# EAGLE design GPIO Board Rev 3 V5 (EAGLE 9.6.2)

## Sheet 1 of 2

## Sheet 2 of 2
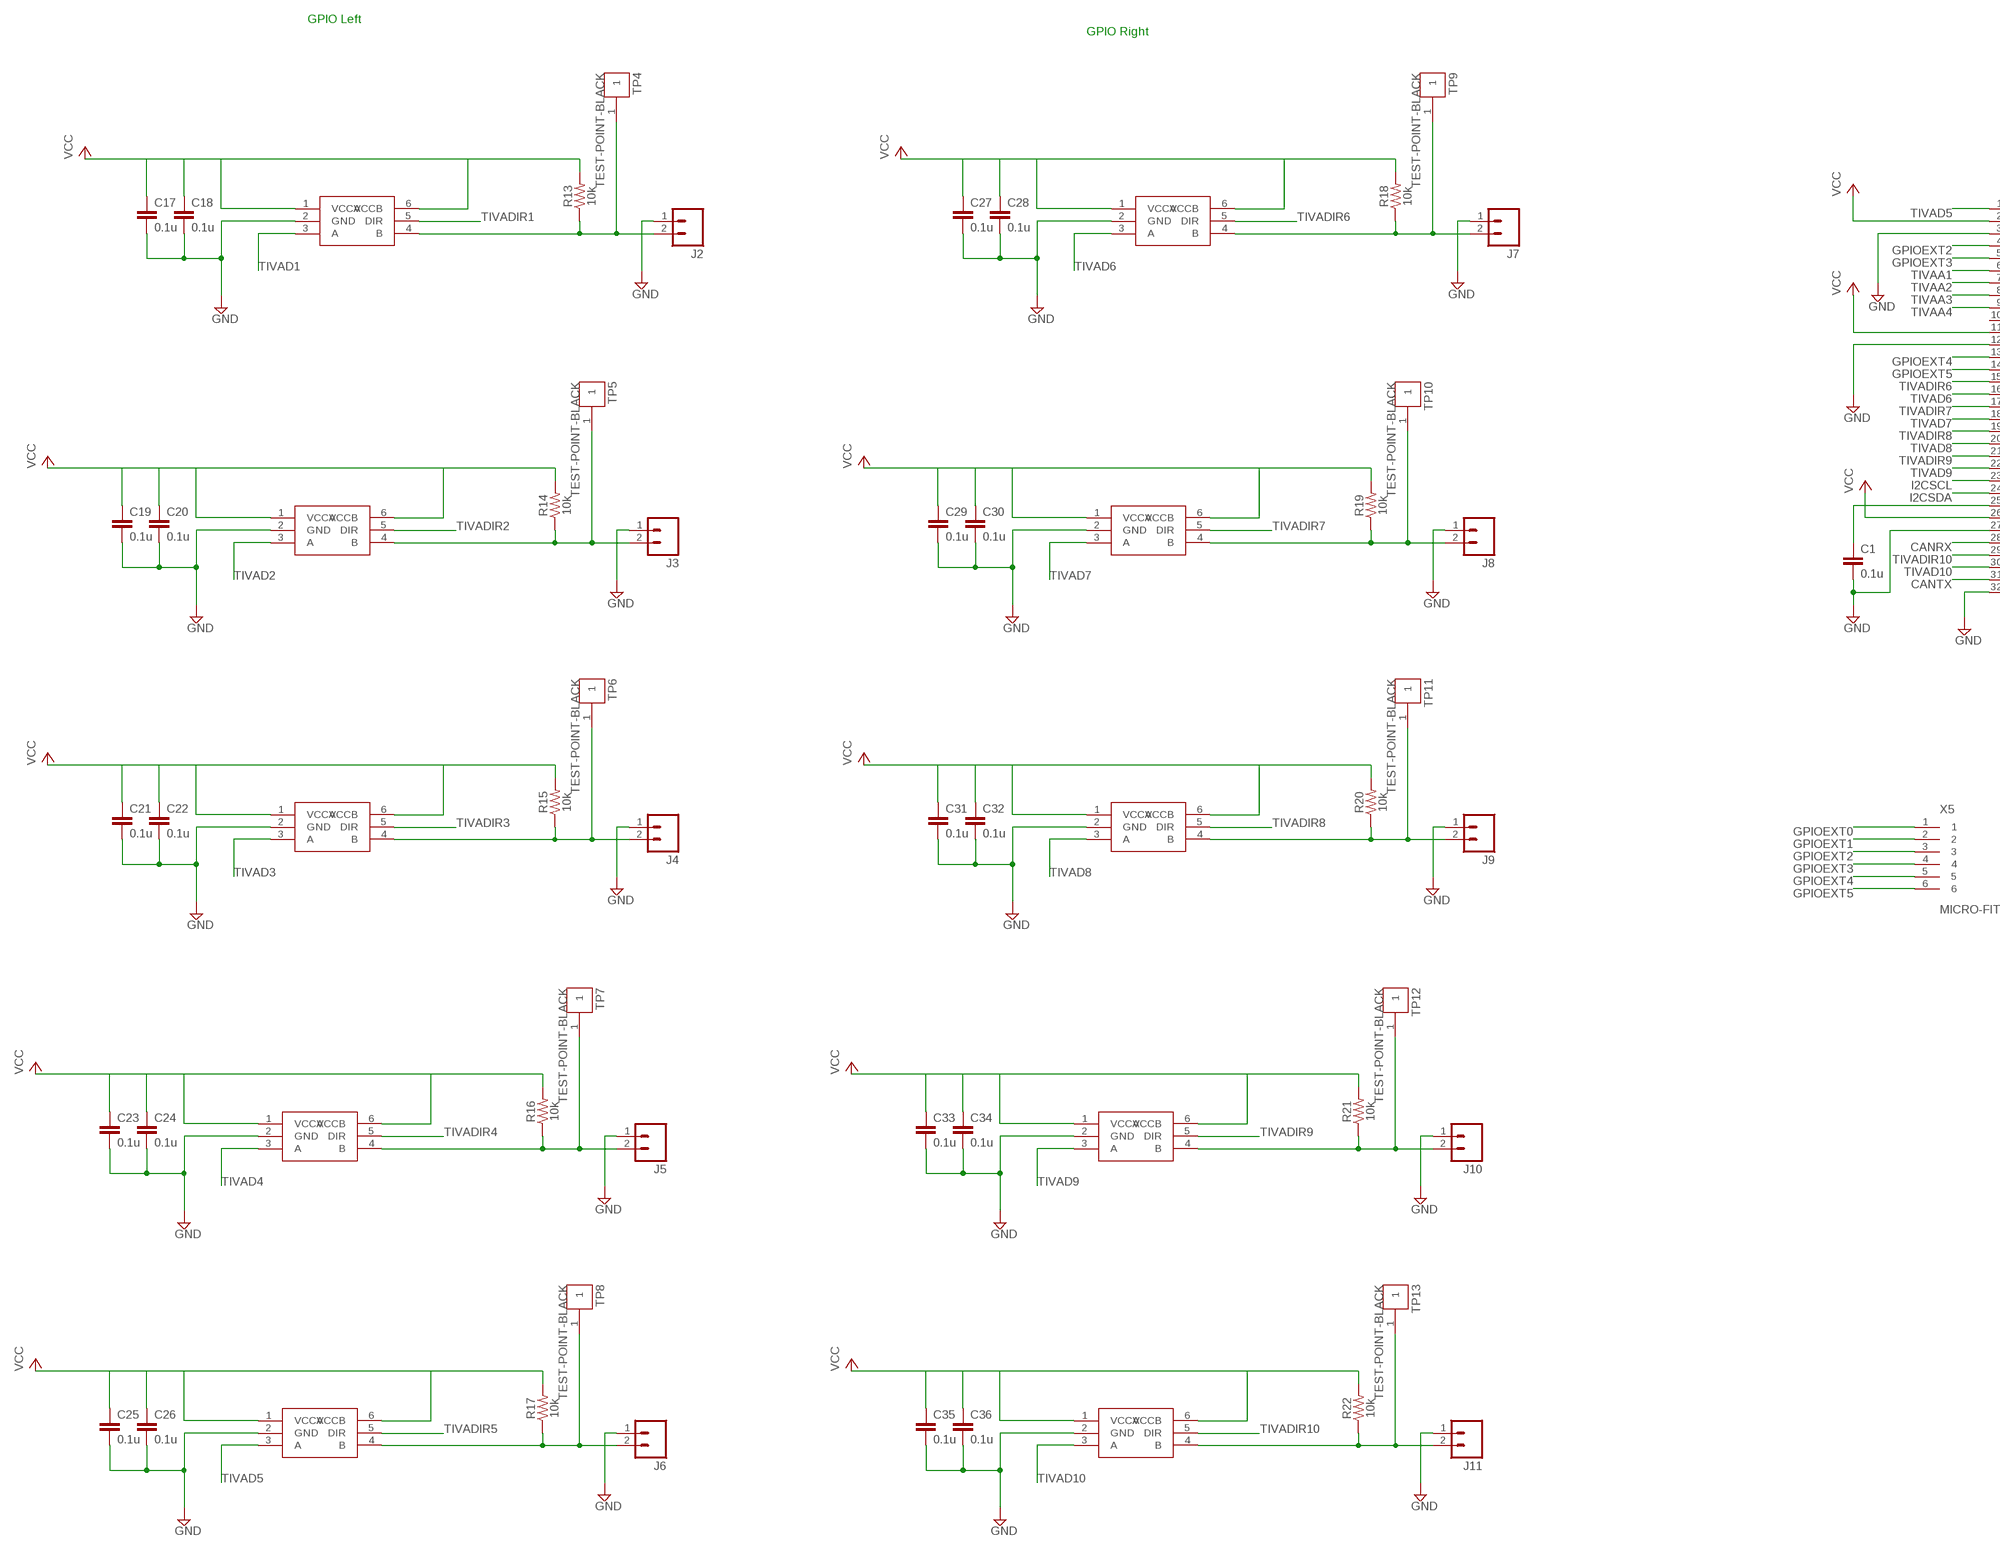
[diagram p0: schematic, sheet 2, part 1 of 3]
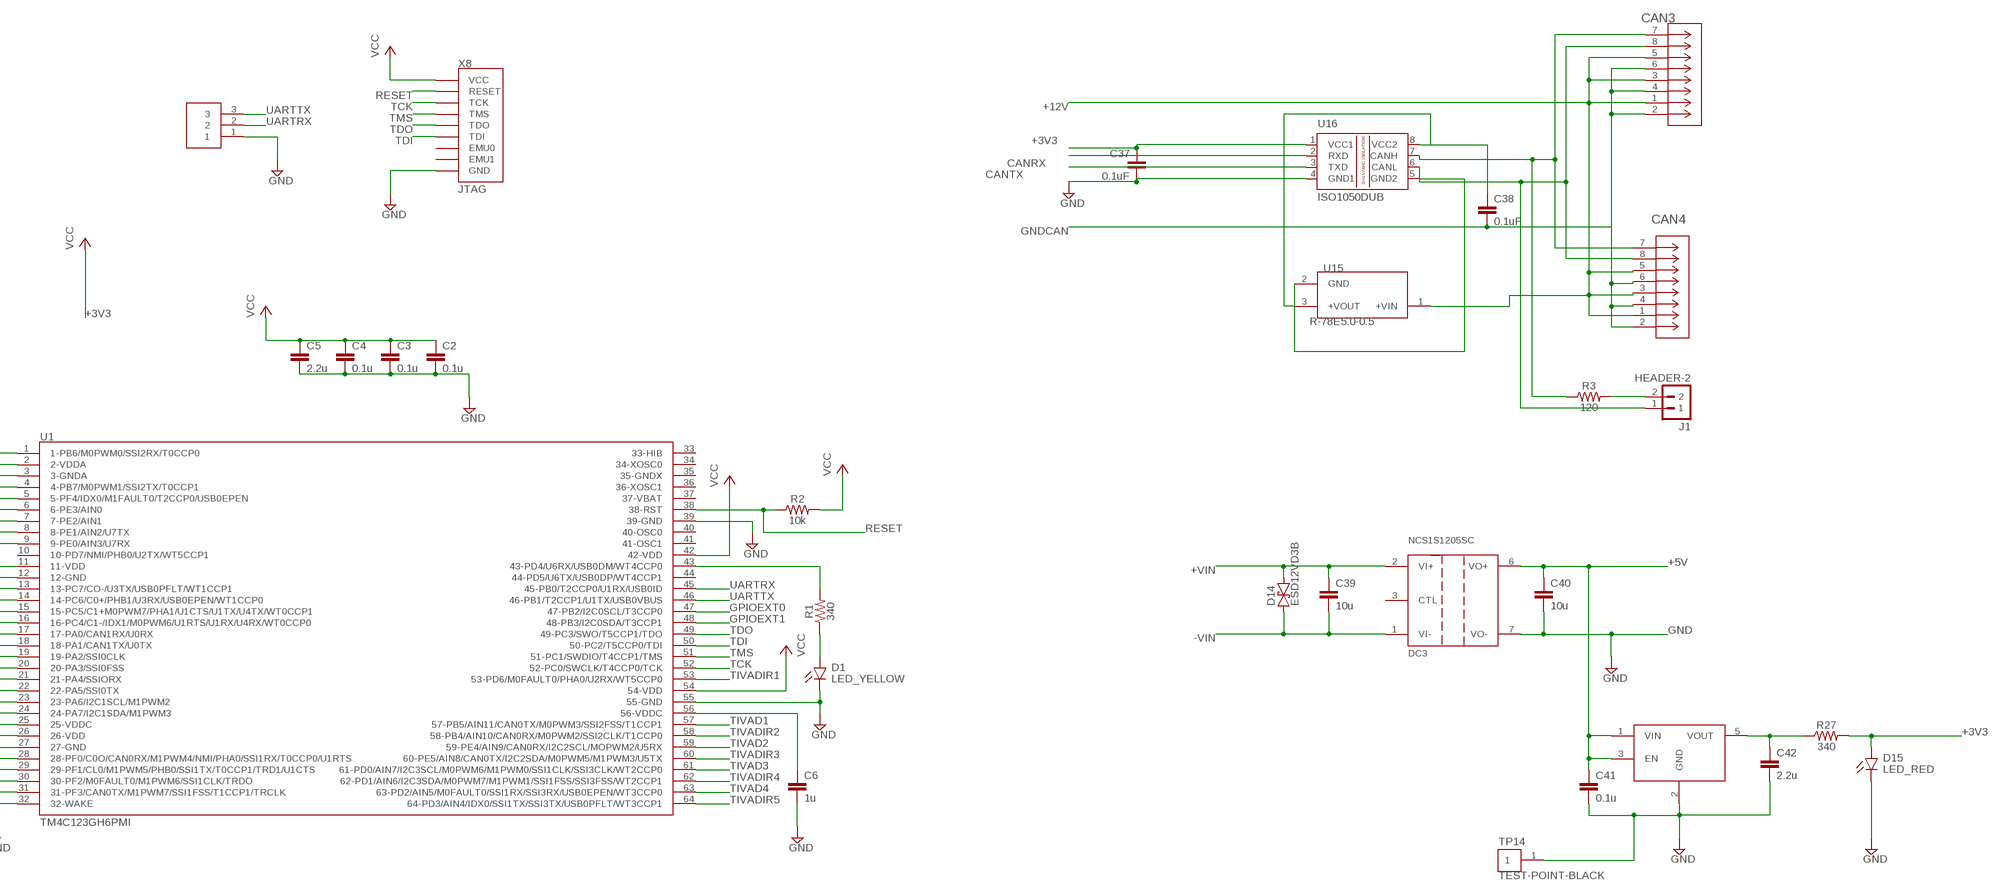
[diagram p1: schematic, sheet 2, part 2 of 3]
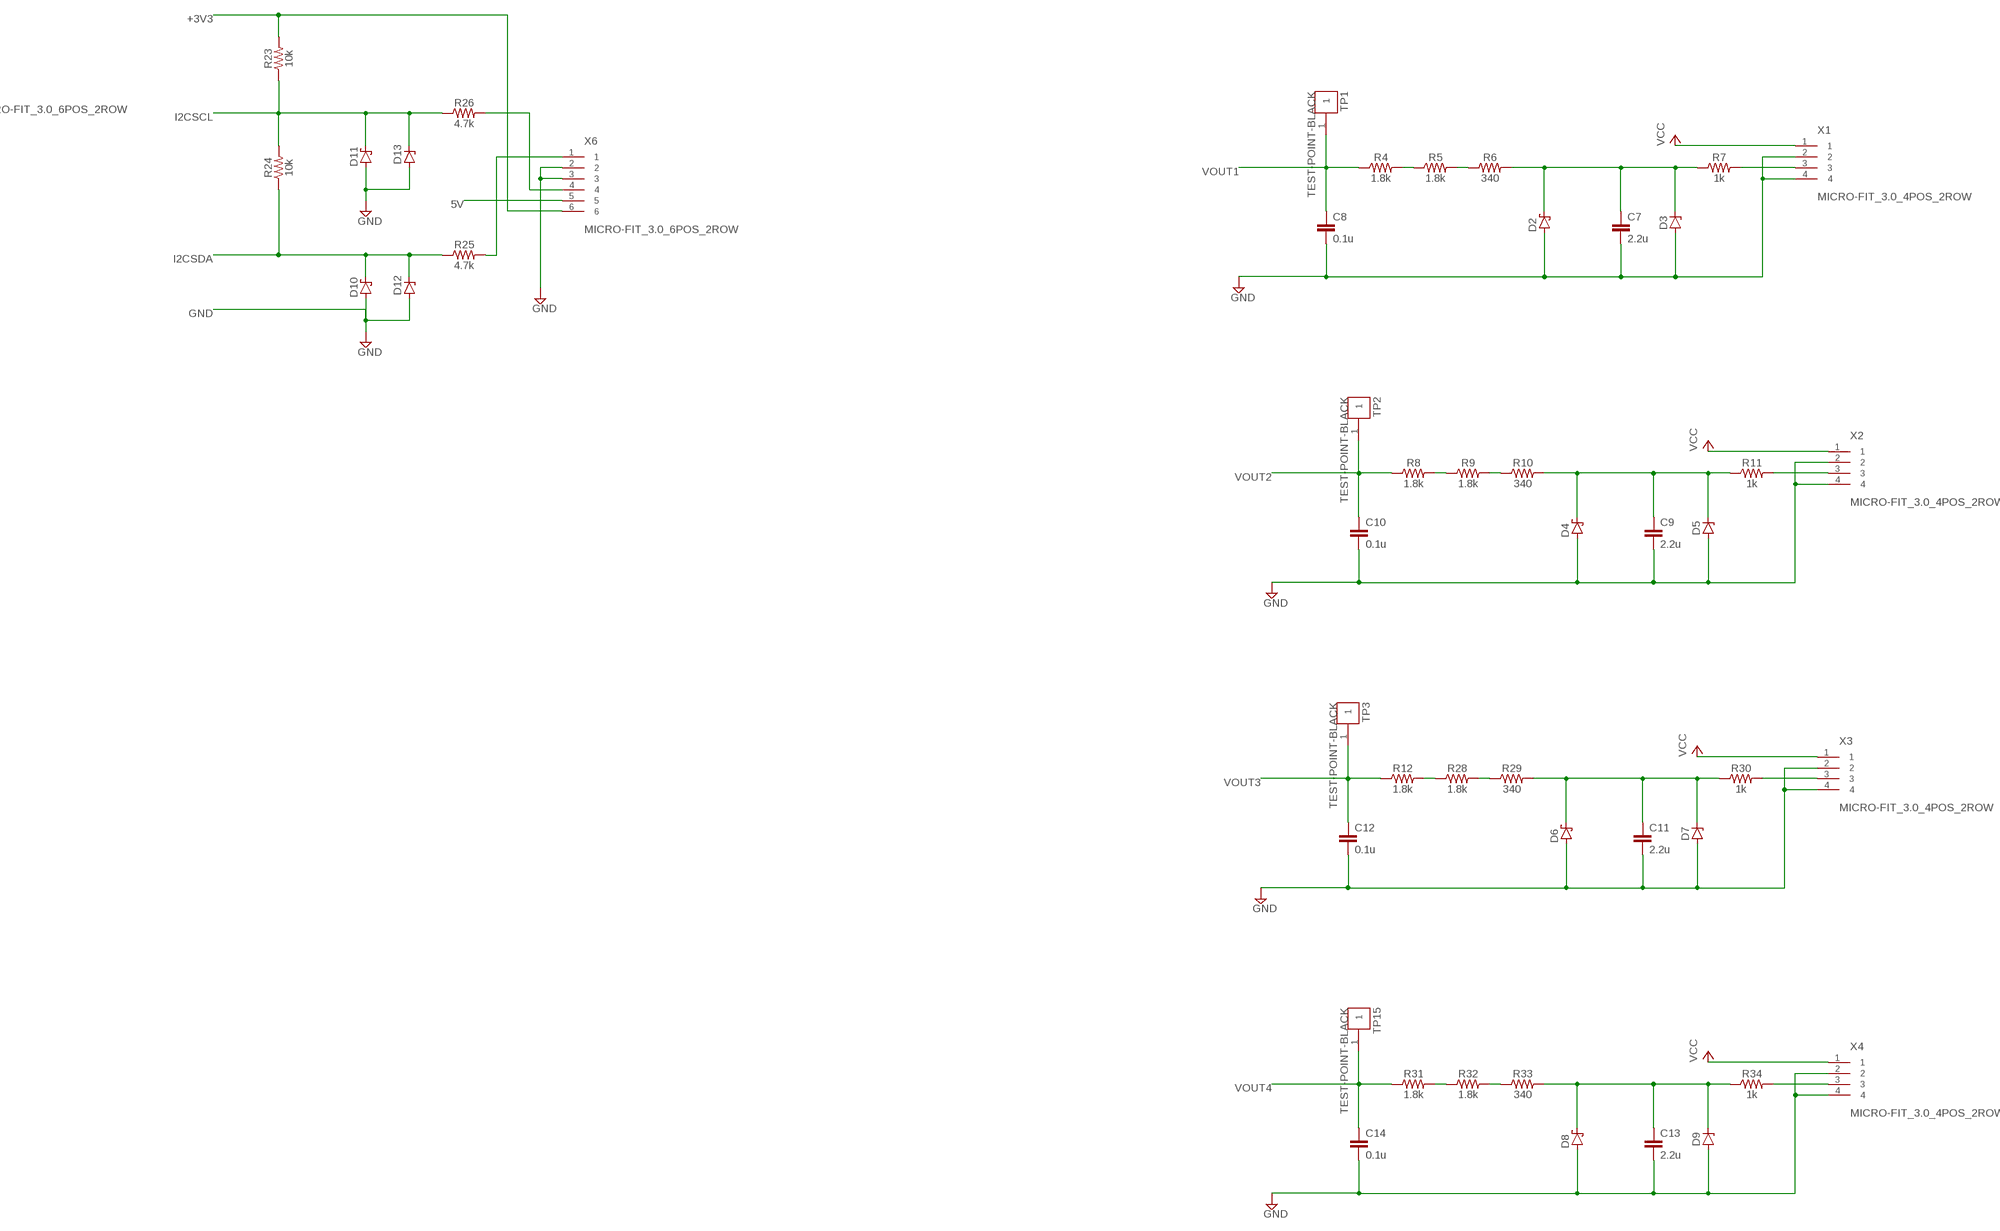
[diagram p2: schematic, sheet 2, part 3 of 3]

### Parts
C1  0.1u  CAP-0.1UF-0603-25V-X8R  [C0603]
C2  0.1u  CAP-0.1UF-0603-25V-X8R  [C0603]
C3  0.1u  CAP-0.1UF-0603-25V-X8R  [C0603]
C4  0.1u  CAP-0.1UF-0603-25V-X8R  [C0603]
C5  2.2u  CAP-2.2UF-0603-6.3V-X7R  [C0603]
C6  1u  CAP-1UF-0603-25V-X7R  [C0603]
C7  2.2u  CAP-2.2UF-0603-6.3V-X7R  [C0603]
C8  0.1u  CAP-0.1UF-0603-25V-X8R  [C0603]
C9  2.2u  CAP-2.2UF-0603-6.3V-X7R  [C0603]
C10  0.1u  CAP-0.1UF-0603-25V-X8R  [C0603]
C11  2.2u  CAP-2.2UF-0603-6.3V-X7R  [C0603]
C12  0.1u  CAP-0.1UF-0603-25V-X8R  [C0603]
C13  2.2u  CAP-2.2UF-0603-6.3V-X7R  [C0603]
C14  0.1u  CAP-0.1UF-0603-25V-X8R  [C0603]
C17  0.1u  CAP-0.1UF-0402-16V-X7R  [C0402]
C18  0.1u  CAP-0.1UF-0402-16V-X7R  [C0402]
C19  0.1u  CAP-0.1UF-0402-16V-X7R  [C0402]
C20  0.1u  CAP-0.1UF-0402-16V-X7R  [C0402]
C21  0.1u  CAP-0.1UF-0402-16V-X7R  [C0402]
C22  0.1u  CAP-0.1UF-0402-16V-X7R  [C0402]
C23  0.1u  CAP-0.1UF-0402-16V-X7R  [C0402]
C24  0.1u  CAP-0.1UF-0402-16V-X7R  [C0402]
C25  0.1u  CAP-0.1UF-0402-16V-X7R  [C0402]
C26  0.1u  CAP-0.1UF-0402-16V-X7R  [C0402]
C27  0.1u  CAP-0.1UF-0402-16V-X7R  [C0402]
C28  0.1u  CAP-0.1UF-0402-16V-X7R  [C0402]
C29  0.1u  CAP-0.1UF-0402-16V-X7R  [C0402]
C30  0.1u  CAP-0.1UF-0402-16V-X7R  [C0402]
C31  0.1u  CAP-0.1UF-0402-16V-X7R  [C0402]
C32  0.1u  CAP-0.1UF-0402-16V-X7R  [C0402]
C33  0.1u  CAP-0.1UF-0402-16V-X7R  [C0402]
C34  0.1u  CAP-0.1UF-0402-16V-X7R  [C0402]
C35  0.1u  CAP-0.1UF-0402-16V-X7R  [C0402]
C36  0.1u  CAP-0.1UF-0402-16V-X7R  [C0402]
C37  0.1uF  C5/3.5  [C5B3.5]
C38  0.1uF  C2.5/4  [C2.5-4]
C39  10u  CAP-10UF-10%-16V-X7R-1206IPC  [1206]
C40  10u  CAP-10UF-10%-16V-X7R-1206IPC  [1206]
C41  0.1u  CAP-0.1UF-0603-25V-X8R  [C0603]
C42  2.2u  CAP-2.2UF-10%-6.3V-X7R-0603IPC  [0603]
CAN3  A-2004-2-4-LPS-N-R  [CONN_4-LPS-N-R_ASM]
CAN4  A-2004-2-4-LPS-N-R  [CONN_4-LPS-N-R_ASM]
D1  LED_YELLOW  CHIP-FLAT-Y_0603-0.35MM  [LEDC1608X35N_FLAT-Y]
D2  SCHOTTKY-DIODESMD  [SMB]
D3  ZENER-DIODESMB  [SMB]
D4  SCHOTTKY-DIODESMD  [SMB]
D5  ZENER-DIODESMB  [SMB]
D6  SCHOTTKY-DIODESMD  [SMB]
D7  ZENER-DIODESMB  [SMB]
D8  SCHOTTKY-DIODESMD  [SMB]
D9  ZENER-DIODESMB  [SMB]
D10  SCHOTTKY-DIODESMD  [SMB]
D11  SCHOTTKY-DIODESMD  [SMB]
D12  ZENER-DIODESOT23  [SOT23]
D13  ZENER-DIODESOT23  [SOT23]
D14  ESD12VD3B  [SOD23]
D15  LED_RED  CHIP-FLAT-R_0805  [LEDC2012X110N_FLAT-R]
DC3  NCS1S1205SC  [7-SIP]
DC4  NCV551SN33T1G  [SOT23-5]
J1  HEADER-2  [HEADER-V-1X2]
J2  M02-JST-2-PTH-NO_SILK  [JST-2-PTH-NS]
J3  M02-JST-2-PTH-NO_SILK  [JST-2-PTH-NS]
J4  M02-JST-2-PTH-NO_SILK  [JST-2-PTH-NS]
J5  M02-JST-2-PTH-NO_SILK  [JST-2-PTH-NS]
J6  M02-JST-2-PTH-NO_SILK  [JST-2-PTH-NS]
J7  M02-JST-2-PTH-NO_SILK  [JST-2-PTH-NS]
J8  M02-JST-2-PTH-NO_SILK  [JST-2-PTH-NS]
J9  M02-JST-2-PTH-NO_SILK  [JST-2-PTH-NS]
J10  M02-JST-2-PTH-NO_SILK  [JST-2-PTH-NS]
J11  M02-JST-2-PTH-NO_SILK  [JST-2-PTH-NS]
R1  340  RES-340OHM-0603-1/10W-1%  [R0603]
R2  10k  RES-10KOHM-0603-1/10W-1%  [R0603]
R3  120  RES-120OHM-0603-1/10W-1%  [R0603]
R4  1.8k  RES-1.8KOHM-0603-1/10W-.1%  [R0603]
R5  1.8k  RES-1.8KOHM-0603-1/10W-.1%  [R0603]
R6  340  RES-340OHM-0603-1/10W-1%  [R0603]
R7  1k  RES-1KOHM-0603-1/10W-1%  [R0603]
R8  1.8k  RES-1.8KOHM-0603-1/10W-.1%  [R0603]
R9  1.8k  RES-1.8KOHM-0603-1/10W-.1%  [R0603]
R10  340  RES-340OHM-0603-1/10W-1%  [R0603]
R11  1k  RES-1KOHM-0603-1/10W-1%  [R0603]
R12  1.8k  RES-1.8KOHM-0603-1/10W-.1%  [R0603]
R13  10k  RES-10KOHM-1%-0.1W-0603IPC  [0603]
R14  10k  RES-10KOHM-1%-0.1W-0603IPC  [0603]
R15  10k  RES-10KOHM-1%-0.1W-0603IPC  [0603]
R16  10k  RES-10KOHM-1%-0.1W-0603IPC  [0603]
R17  10k  RES-10KOHM-1%-0.1W-0603IPC  [0603]
R18  10k  RES-10KOHM-1%-0.1W-0603IPC  [0603]
R19  10k  RES-10KOHM-1%-0.1W-0603IPC  [0603]
R20  10k  RES-10KOHM-1%-0.1W-0603IPC  [0603]
R21  10k  RES-10KOHM-1%-0.1W-0603IPC  [0603]
R22  10k  RES-10KOHM-1%-0.1W-0603IPC  [0603]
R23  10k  RES-10KOHM-0603-1/10W-1%  [R0603]
R24  10k  RES-10KOHM-0603-1/10W-1%  [R0603]
R25  4.7k  RES-4.7KOHM-0603-1/10W-1%  [R0603]
R26  4.7k  RES-4.7KOHM-0603-1/10W-1%  [R0603]
R27  340  RES-340OHM-0603-1/10W-1%  [R0603]
R28  1.8k  RES-1.8KOHM-0603-1/10W-.1%  [R0603]
R29  340  RES-340OHM-0603-1/10W-1%  [R0603]
R30  1k  RES-1KOHM-0603-1/10W-1%  [R0603]
R31  1.8k  RES-1.8KOHM-0603-1/10W-.1%  [R0603]
R32  1.8k  RES-1.8KOHM-0603-1/10W-.1%  [R0603]
R33  340  RES-340OHM-0603-1/10W-1%  [R0603]
R34  1k  RES-1KOHM-0603-1/10W-1%  [R0603]
TP1  TEST-POINT-BLACK  [KEYSTONE_5001_0]
TP2  TEST-POINT-BLACK  [KEYSTONE_5001_0]
TP3  TEST-POINT-BLACK  [KEYSTONE_5001_0]
TP4  TEST-POINT-BLACK  [KEYSTONE_5001_0]
TP5  TEST-POINT-BLACK  [KEYSTONE_5001_0]
TP6  TEST-POINT-BLACK  [KEYSTONE_5001_0]
TP7  TEST-POINT-BLACK  [KEYSTONE_5001_0]
TP8  TEST-POINT-BLACK  [KEYSTONE_5001_0]
TP9  TEST-POINT-BLACK  [KEYSTONE_5001_0]
TP10  TEST-POINT-BLACK  [KEYSTONE_5001_0]
TP11  TEST-POINT-BLACK  [KEYSTONE_5001_0]
TP12  TEST-POINT-BLACK  [KEYSTONE_5001_0]
TP13  TEST-POINT-BLACK  [KEYSTONE_5001_0]
TP14  TEST-POINT-BLACK  [KEYSTONE_5001_0]
TP15  TEST-POINT-BLACK  [KEYSTONE_5001_0]
U1  TM4C123GH6PMI  [S-PQFP-G64]
U5  SN74LVC1T45-Q1  [SC70]
U6  SN74LVC1T45-Q1  [SC70]
U7  SN74LVC1T45-Q1  [SC70]
U8  SN74LVC1T45-Q1  [SC70]
U9  SN74LVC1T45-Q1  [SC70]
U10  SN74LVC1T45-Q1  [SC70]
U11  SN74LVC1T45-Q1  [SC70]
U12  SN74LVC1T45-Q1  [SC70]
U13  SN74LVC1T45-Q1  [SC70]
U14  SN74LVC1T45-Q1  [SC70]
U15  R-78E5.0-0.5  [CONV_R-78E5.0-0.5]
U16  ISO1050DUB  [DUB-R-PDSO-G8]
U$2  HEADER-3  [HEADER-V-1X3]
X1  MICRO-FIT_3.0_4POS_2ROW  [0430450412]
X2  MICRO-FIT_3.0_4POS_2ROW  [0430450412]
X3  MICRO-FIT_3.0_4POS_2ROW  [0430450412]
X4  MICRO-FIT_3.0_4POS_2ROW  [0430450412]
X5  MICRO-FIT_3.0_6POS_2ROW  [0430450612]
X6  MICRO-FIT_3.0_6POS_2ROW  [0430450612]
X8  JTAG  [HEADER-V-2X7]

### Nets
5V: X6.5
+3V3: C37.2 D15.A R23.2 R27.2 U16.1(VCC1) X6.6 ; supply symbol labelled VCC
+5V: C40.1 C41.1 DC3.6(VO+) DC4.1(VIN) DC4.3(EN)
+12V: CAN3.1 CAN3.3 CAN3.5 CAN4.1 CAN4.3 CAN4.5 U15.1(+VIN)
+VIN: C39.1 D14.2 DC3.2(VI+)
-VIN: C39.2 D14.1 DC3.1(VI-)
CANRX: U1.28(28-PF0/C0O/CAN0RX/M1PWM4/NMI/PHA0/SSI1RX/T0CCP0/U1RTS) U16.2(RXD)
CANTX: U1.31(31-PF3/CAN0TX/M1PWM7/SSI1FSS/T1CCP1/TRCLK) U16.3(TXD)
GND: C1.2 C2.2 C3.2 C4.2 C5.2 C6.2 C7.2 C8.2 C9.2 C10.2 C11.2 C12.2 C13.2 C14.2 C17.2 C18.2 C19.2 C20.2 C21.2 C22.2 C23.2 C24.2 C25.2 C26.2 C27.2 C28.2 C29.2 C30.2 C31.2 C32.2 C33.2 C34.2 C35.2 C36.2 C37.1 C40.2 C41.2 C42.2 D1.C D2.A D3.A D4.A D5.A D6.A D7.A D8.A D9.A D10.A D11.A D12.1(A) D13.1(A) D15.C DC3.7(VO-) DC4.2(GND) J2.1 J3.1 J4.1 J5.1 J6.1 J7.1 J8.1 J9.1 J10.1 J11.1 TP14.1 U1.3(3-GNDA) U1.12(12-GND) U1.27(27-GND) U1.32(32-WAKE) U1.39(39-GND) U1.55(55-GND) U5.2(GND) U6.2(GND) U7.2(GND) U8.2(GND) U9.2(GND) U10.2(GND) U11.2(GND) U12.2(GND) U13.2(GND) U14.2(GND) U16.4(GND1) U$2.1 X1.2 X1.4 X2.2 X2.4 X3.2 X3.4 X4.2 X4.4 X6.2 X6.3 X8.4(GND) X8.6(GND) X8.8(GND) X8.10(GND) X8.12(GND)
GNDCAN: C38.2 CAN3.2 CAN3.4 CAN3.6 CAN4.2 CAN4.4 CAN4.6
GPIOEXT0: U1.47(47-PB2/I2C0SCL/T3CCP0) X5.1
GPIOEXT1: U1.48(48-PB3/I2C0SDA/T3CCP1) X5.2
GPIOEXT2: U1.4(4-PB7/M0PWM1/SSI2TX/T0CCP1) X5.3
GPIOEXT3: U1.5(5-PF4/IDX0/M1FAULT0/T2CCP0/USB0EPEN) X5.4
GPIOEXT4: U1.13(13-PC7/CO-/U3TX/USB0PFLT/WT1CCP1) X5.5
GPIOEXT5: U1.14(14-PC6/C0+/PHB1/U3RX/USB0EPEN/WT1CCP0) X5.6
I2CSCL: D11.C D13.3(C) R23.1 R24.2 R26.1 U1.23(23-PA6/I2C1SCL/M1PWM2)
I2CSDA: D10.C D12.3(C) R24.1 R25.1 U1.24(24-PA7/I2C1SDA/M1PWM3)
N$1: R1.2 U1.43(43-PD4/U6RX/USB0DM/WT4CCP0)
N$2: D1.A R1.1
N$3: J1.2 R3.2
N$4: CAN3.7 CAN4.7 R3.1 U16.7(CANH)
N$5: C1.1 U1.25(25-VDDC)
N$6: CAN3.8 CAN4.8 J1.1 U16.6(CANL)
N$7: R7.2 X1.3
N$8: C6.1 U1.56(56-VDDC)
N$9: C7.1 D2.C D3.C R6.2 R7.1
N$10: R5.2 R6.1
N$11: R4.2 R5.1
N$12: R11.2 X2.3
N$13: C9.1 D4.C D5.C R10.2 R11.1
N$14: R9.2 R10.1
N$15: R8.2 R9.1
N$16: R30.2 X3.3
N$17: C11.1 D6.C D7.C R29.2 R30.1
N$18: R28.2 R29.1
N$19: R12.2 R28.1
N$20: R34.2 X4.3
N$21: J2.2 R13.1 TP4.1 U5.4(B)
N$22: U5.1(VCCA)
N$23: J7.2 R18.1 TP9.1 U10.4(B)
N$24: C17.1
N$25: J3.2 R14.1 TP5.1 U6.4(B)
N$26: U6.1(VCCA)
N$27: U10.1(VCCA)
N$28: C19.1
N$29: J4.2 R15.1 TP6.1 U7.4(B)
N$30: U7.1(VCCA)
N$31: C27.1
N$32: C21.1
N$33: J5.2 R16.1 TP7.1 U8.4(B)
N$34: U8.1(VCCA)
N$35: J8.2 R19.1 TP10.1 U11.4(B)
N$36: C23.1
N$37: J6.2 R17.1 TP8.1 U9.4(B)
N$38: U9.1(VCCA)
N$39: U11.1(VCCA)
N$40: C25.1
N$41: C29.1
N$42: J9.2 R20.1 TP11.1 U12.4(B)
N$43: U12.1(VCCA)
N$44: C31.1
N$45: J10.2 R21.1 TP12.1 U13.4(B)
N$46: U13.1(VCCA)
N$47: C33.1
N$48: J11.2 R22.1 TP13.1 U14.4(B)
N$49: U14.1(VCCA)
N$50: C35.1
N$51: R26.2 X6.4
N$52: R25.2 X6.1
N$53: C13.1 D8.C D9.C R33.2 R34.1
N$54: R32.2 R33.1
N$55: U15.3(+VOUT)
N$56: U15.2(GND) U16.5(GND2)
N$57: C38.1 U16.8(VCC2)
N$58: C42.1 DC4.5(VOUT) R27.1
N$59: R31.2 R32.1
RESET: R2.1 U1.38(38-RST) X8.2(RESET)
TCK: U1.52(52-PC0/SWCLK/T4CCP0/TCK) X8.9(TCK) X8.11(TCK)
TDI: U1.50(50-PC2/T5CCP0/TDI) X8.3(TDI)
TDO: U1.49(49-PC3/SWO/T5CCP1/TDO) X8.7(TDO)
TIVAA1: U1.6(6-PE3/AIN0)
TIVAA2: U1.7(7-PE2/AIN1)
TIVAA3: U1.8(8-PE1/AIN2/U7TX)
TIVAA4: U1.9(9-PE0/AIN3/U7RX)
TIVAD1: U1.57(57-PB5/AIN11/CAN0TX/M0PWM3/SSI2FSS/T1CCP1) U5.3(A)
TIVAD2: U1.59(59-PE4/AIN9/CAN0RX/I2C2SCL/MOPWM2/U5RX) U6.3(A)
TIVAD3: U1.61(61-PD0/AIN7/I2C3SCL/M0PWM6/M1PWM0/SSI1CLK/SSI3CLK/WT2CCP0) U7.3(A)
TIVAD4: U1.63(63-PD2/AIN5/M0FAULT0/SSI1RX/SSI3RX/USB0EPEN/WT3CCP0) U8.3(A)
TIVAD5: U1.1(1-PB6/M0PWM0/SSI2RX/T0CCP0) U9.3(A)
TIVAD6: U1.16(16-PC4/C1-/IDX1/M0PWM6/U1RTS/U1RX/U4RX/WT0CCP0) U10.3(A)
TIVAD7: U1.18(18-PA1/CAN1TX/U0TX) U11.3(A)
TIVAD8: U1.20(20-PA3/SSI0FSS) U12.3(A)
TIVAD9: U1.22(22-PA5/SSI0TX) U13.3(A)
TIVAD10: U1.30(30-PF2/M0FAULT0/M1PWM6/SSI1CLK/TRDO) U14.3(A)
TIVADIR1: U1.53(53-PD6/M0FAULT0/PHA0/U2RX/WT5CCP0) U5.5(DIR)
TIVADIR2: U1.58(58-PB4/AIN10/CAN0RX/M0PWM2/SSI2CLK/T1CCP0) U6.5(DIR)
TIVADIR3: U1.60(60-PE5/AIN8/CAN0TX/I2C2SDA/M0PWM5/M1PWM3/U5TX) U7.5(DIR)
TIVADIR4: U1.62(62-PD1/AIN6/I2C3SDA/M0PWM7/M1PWM1/SSI1FSS/SSI3FSS/WT2CCP1) U8.5(DIR)
TIVADIR5: U1.64(64-PD3/AIN4/IDX0/SSI1TX/SSI3TX/USB0PFLT/WT3CCP1) U9.5(DIR)
TIVADIR6: U1.15(15-PC5/C1+M0PWM7/PHA1/U1CTS/U1TX/U4TX/WT0CCP1) U10.5(DIR)
TIVADIR7: U1.17(17-PA0/CAN1RX/U0RX) U11.5(DIR)
TIVADIR8: U1.19(19-PA2/SSI0CLK) U12.5(DIR)
TIVADIR9: U1.21(21-PA4/SSIORX) U13.5(DIR)
TIVADIR10: U1.29(29-PF1/CL0/M1PWM5/PHB0/SSI1TX/T0CCP1/TRD1/U1CTS) U14.5(DIR)
TMS: U1.51(51-PC1/SWDIO/T4CCP1/TMS) X8.1(TMS)
UARTRX: U1.45(45-PB0/T2CCP0/U1RX/USB0ID) U$2.2
UARTTX: U1.46(46-PB1/T2CCP1/U1TX/USB0VBUS) U$2.3
VCC: C2.1 C3.1 C4.1 C5.1 C18.1 C20.1 C22.1 C24.1 C26.1 C28.1 C30.1 C32.1 C34.1 C36.1 R2.2 R13.2 R14.2 R15.2 R16.2 R17.2 R18.2 R19.2 R20.2 R21.2 R22.2 U1.2(2-VDDA) U1.11(11-VDD) U1.26(26-VDD) U1.42(42-VDD) U1.54(54-VDD) U5.6(VCCB) U6.6(VCCB) U7.6(VCCB) U8.6(VCCB) U9.6(VCCB) U10.6(VCCB) U11.6(VCCB) U12.6(VCCB) U13.6(VCCB) U14.6(VCCB) X1.1 X2.1 X3.1 X4.1 X8.5(VCC)
VOUT1: C8.1 R4.1 TP1.1
VOUT2: C10.1 R8.1 TP2.1
VOUT3: C12.1 R12.1 TP3.1
VOUT4: C14.1 R31.1 TP15.1
Unconnected: DC3.3(CTL) U1.10(10-PD7/NMI/PHB0/U2TX/WT5CCP1) U1.33(33-HIB) U1.34(34-XOSC0) U1.35(35-GNDX) U1.36(36-XOSC1) U1.37(37-VBAT) U1.40(40-OSC0) U1.41(41-OSC1) U1.44(44-PD5/U6TX/USB0DP/WT4CCP1) X8.13(EMU0) X8.14(EMU1)

### Notes on the sheet
- GPIO Left
- GPIO Right

## Library data of the parts
C1-C4 C8 C10 C12 C14 C41 = gtsr-passive:CAP-0.1UF: 0.1µF Ceramic Capacitor; MANUFACTURER: Murata Electronics; MFPN: GCM188R91E104KA37D; SUPPLIER: Digi-Key; SUPPLIER_PN: 490-14359-1-ND
C5 C7 C9 C11 C13 = gtsr-passive:CAP-2.2UF: 2.2µF Ceramic Capacitor; AUTOMOTIVE: Yes; MANUFACTURER: Murata; MFPN: GCM188R70J225KE22J; SUPPLIER: Digikey; SUPPLIER_PN: 490-14529-1-ND
C6 = gtsr-passive:CAP-1UF: 1µF Ceramic Capacitor; MANUFACTURER: Murata; MFPN: GCM188R71E105KA64D; SUPPLIER: Digikey; SUPPLIER_PN: 490-10673-1-ND
C17-C36 = gtsr-passive:CAP-0.1UF: 0.1µF Ceramic Capacitor; MANUFACTURER: Murata; MFPN: GCM155R71C104KA55D; SUPPLIER: Digikey; SUPPLIER_PN: 490-4759-1-ND
C37 C38 = capacitor-wima:C: CAPACITOR naming: grid - package width
C39 C40 = gtsr-passive:CAP-10UF: 10µF Ceramic Capacitor; MFR: Murata Electronics; MPN: GCM31CR71C106KA64K; SPN: 490-14746-1-ND; SPR: Digi-Key
C42 = gtsr-passive:CAP-2.2UF: 2.2µF Ceramic Capacitor; MFR: Murata Electronics; MPN: GCM188R70J225KE22D; SPN: 490-5316-1-ND; SPR: Digi-Key
CAN3 CAN4 = A-2004-2-4-LPS-N-R:A-2004-2-4-LPS-N-R; COPYRIGHT: Copyright (C) 2021 Ultra Librarian. All rights reserved.; DIGI-KEY_PART_NUMBER_1: AE10387-ND; MANUFACTURER_PART_NUMBER: A-2004-2-4-LPS-N-R; MFR_NAME: Assmann
D1 = LED:CHIP-FLAT-Y; CATEGORY: LED; COLOR: YELLOW; DESCRIPTION: CHIP LED FLAT; SUB-CATEGORY: CHIP; TYPE: FLAT_TOP
D2 D4 D6 D8 D10 D11 = diode:SCHOTTKY-DIODE: Schottky Diode
D3 D5 D7 D9 D12 D13 = diode:ZENER-DIODE: Z-Diode
D14 = gtsr-diode:ESD12VD3B; MANUFACTURER: Micro Commercial Co; MFPN: ESD12VD3B-TP; SUPPLIER: Digikey; SUPPLIER_PN: ESD12VD3B-TPMSCT-ND
D15 = LED:CHIP-FLAT-R; CATEGORY: LED; COLOR: RED; DESCRIPTION: CHIP LED FLAT; SUB-CATEGORY: CHIP; TYPE: FLAT_TOP
DC3 = gtsr-power-supply:NCS1S1205SC: Isolated Module DC DC Converter 1 Output 5V 200mA 4.5V - 18V Input; MANUFACTURER: Murata; MFPN: NCS1S1205SC; SUPPLIER: Digikey; SUPPLIER_PN: 811-2945-ND
DC4 = gtsr-power-supply:NCV551; AUTOMOTIVE: Yes; MANUFACTURER: ON Semiconductor; MFPN: NCV551SN33T1G; SUPPLIER: Digikey; SUPPLIER_PN: NCV551SN33T1GOSCT-ND; VOUT: 3.3
J1 = gtsr-connector:HEADER-2; MANUFACTURER: Molex; MFPN: 0022284027; SUPPLIER: Digikey; SUPPLIER_PN: WM24201-ND
J2-J11 = gtsr-connector:M02: Standard 2-pin 0.1" header. Use with - straight break away headers ( PRT-00116) - right angle break away headers (PRT-00553) - swiss pins (PRT-00743) - machine pins (PRT-00117) - female headers (PRT-00115) Molex polarized connector foot print use with: PRT-08233 with associated crimp pins and housings. 2.54_SCREWTERM for use with PRT-10571. 3.5mm Screw Terminal footprints for PRT-08084 5mm Screw Terminal footprints for use with PRT-08432 Copied from SparkFun Connector
R1 R6 R10 R27 R29 R33 = gtsr-passive:RES-340OHM; MANUFACTURER: Panasonic; MFPN: ERJ-3EKF3400V; SUPPLIER: Digikey; SUPPLIER_PN: P340HCT-ND
R2 R23 R24 = gtsr-passive:RES-10KOHM; MANUFACTURER: Panasonic; MFPN: ERJ-3EKF1002V; SUPPLIER: Digikey; SUPPLIER_PN: P10.0KHCT-ND
R3 = gtsr-passive:RES-120OHM; MANUFACTURER: Panasonic; MFPN: ERJ-3EKF1200V; SUPPLIER: Digikey; SUPPLIER_PN: P120HTR-ND
R4 R5 R8 R9 R12 R28 R31 R32 = gtsr-passive:RES-1.8KOHM; AUTOMOTIVE: Yes; MANUFACTURER: Panasonic; MFPN: ERA-3AEB182V; RESISTANCE: 1.8k; SUPPLIER: Digikey; SUPPLIER_PN: P1.8KDBCT-ND
R7 R11 R30 R34 = gtsr-passive:RES-1KOHM; MANUFACTURER: Panasonic; MFPN: ERJ-3EKF1001V; SUPPLIER: Digikey; SUPPLIER_PN: P1.00KHCT-ND
R13-R22 = gtsr-passive:RES-10KOHM; MFR: Panasonic Electronic Components; MPN: ERJ-3EKF1002V; SPN: P10.0KHCT-ND; SPR: Digi-Key
R25 R26 = gtsr-passive:RES-4.7KOHM; MANUFACTURER: Panasonic Electronic Components; MFPN: ERJ-3EKF4701V; SUPPLIER: Digi-Key; SUPPLIER_PN: P4.70KHCT-ND
TP1-TP15 = gtsr-connector:TEST-POINT: BLACK THRU-HOLE MOUNT TEST POINT; MANUFACTURER: Keystone Electronics; MFPN: 5001; SUPPLIER: Digikey; SUPPLIER_PN: 36-5001-ND
U1 = gtsr-digital-ic:TM4C1; MFR: Texas Instruments; MPN: TM4C123GH6PMI; SPN: 296-35848-ND; SPR: Digi-Key
U5-U14 = gtsr-digital-ic:SN74LVC1T45-Q1; MANUFACTURER: Texas Instruments; MFPN: SN74LVC1T45QDCKRQ1; SUPPLIER: Digikey; SUPPLIER_PN: 296-39212-1-ND
U15 = R-78E5.0-0.5:R-78E5.0-0.5: 0.5 Amp SIP3 Single Output; DESCRIPTION: Switching regulator module - DC/DC converter . Single Output. 7.0V to 28.0V input voltage range and 5 V output voltage range; DIGI-KEY_PART_NUMBER: 945-1648-5-ND; MF: Recom Power; MP: R-78E5.0-0.5; PACKAGE: SIP-3 Recom Power; PURCHASE-URL: https://pricing.snapeda.com/search/part/R-78E5.0-0.5/?ref=eda
U16 = texas:ISO1050: ISOLATED CAN TRANSCEIVER Source: http://focus.ti.com/lit/ds/symlink/iso1050.pdf; MPN: ISO1050DUBR; OC_FARNELL: 1755712; OC_NEWARK: 14R9899
U$2 = gtsr-connector:HEADER-3; MANUFACTURER: Molex; MFPN: 0901200763; SUPPLIER: Digikey; SUPPLIER_PN: WM8085-ND
X1-X4 = gtsr-connector:MICRO-FIT_3.0_4POS; MANUFACTURER: Molex; MFPN: 0430450412; SUPPLIER: Digi-Key; SUPPLIER_PN: WM1790-ND
X5 X6 = gtsr-connector:MICRO-FIT_3.0_6POS; MANUFACTURER: Molex; MFPN: 0430450612; SUPPLIER: Digi-Key; SUPPLIER_PN: WM1791-ND
X8 = gtsr-connector:JTAG; MANUFACTURER: TE Connectivity; MFPN: 2-1761603-5; SUPPLIER: Digikey; SUPPLIER_PN: A97471-ND

## Board
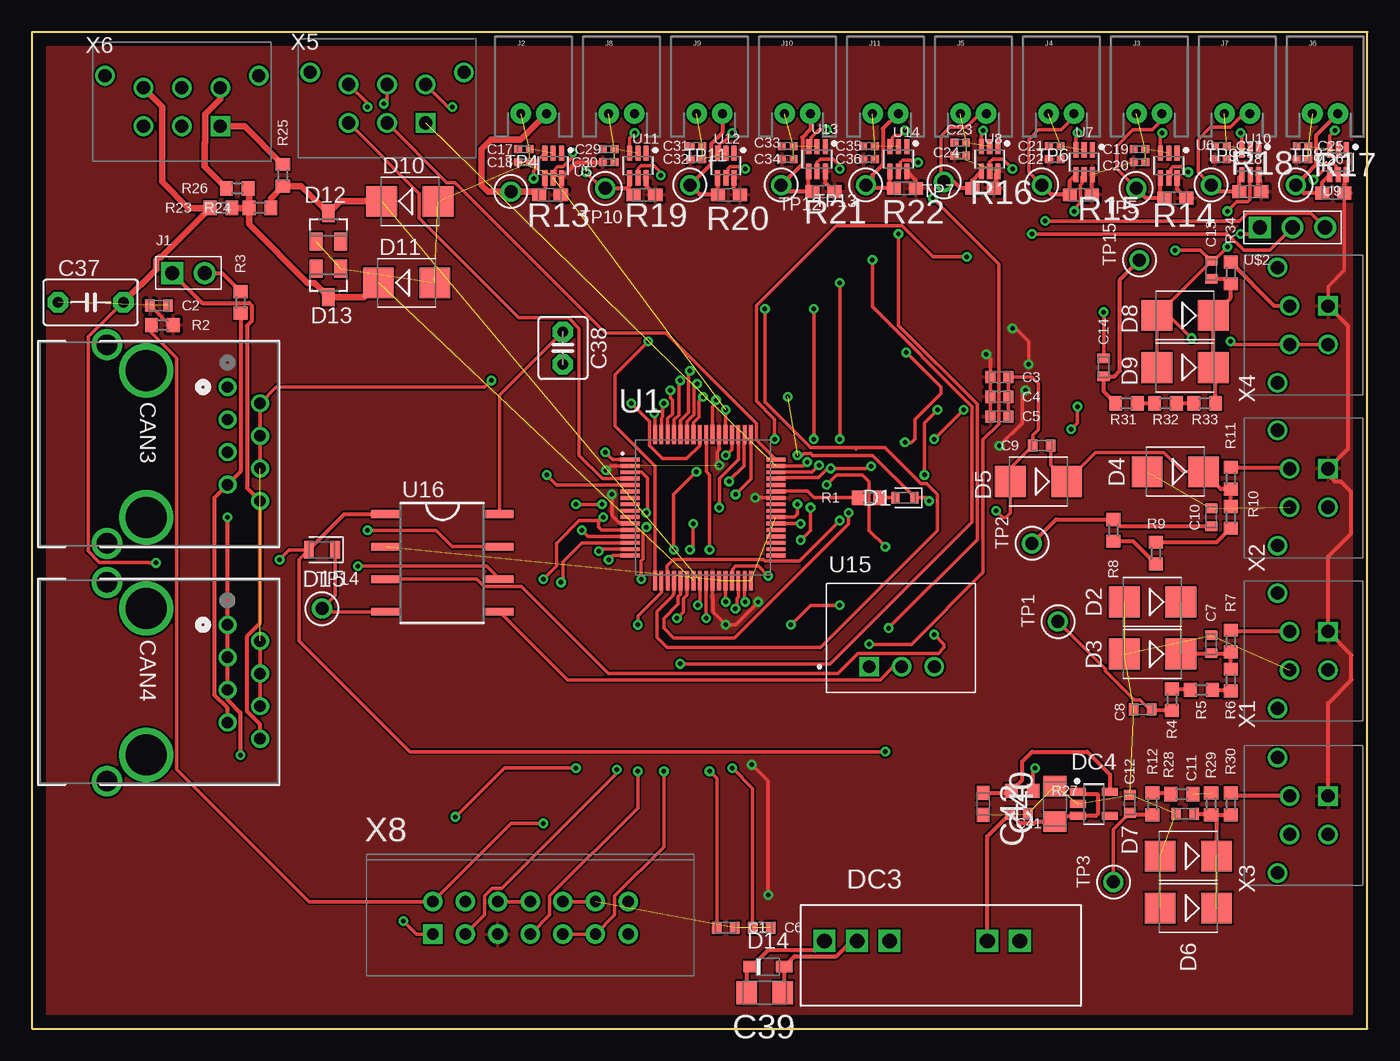
[diagram p3: board, top side]
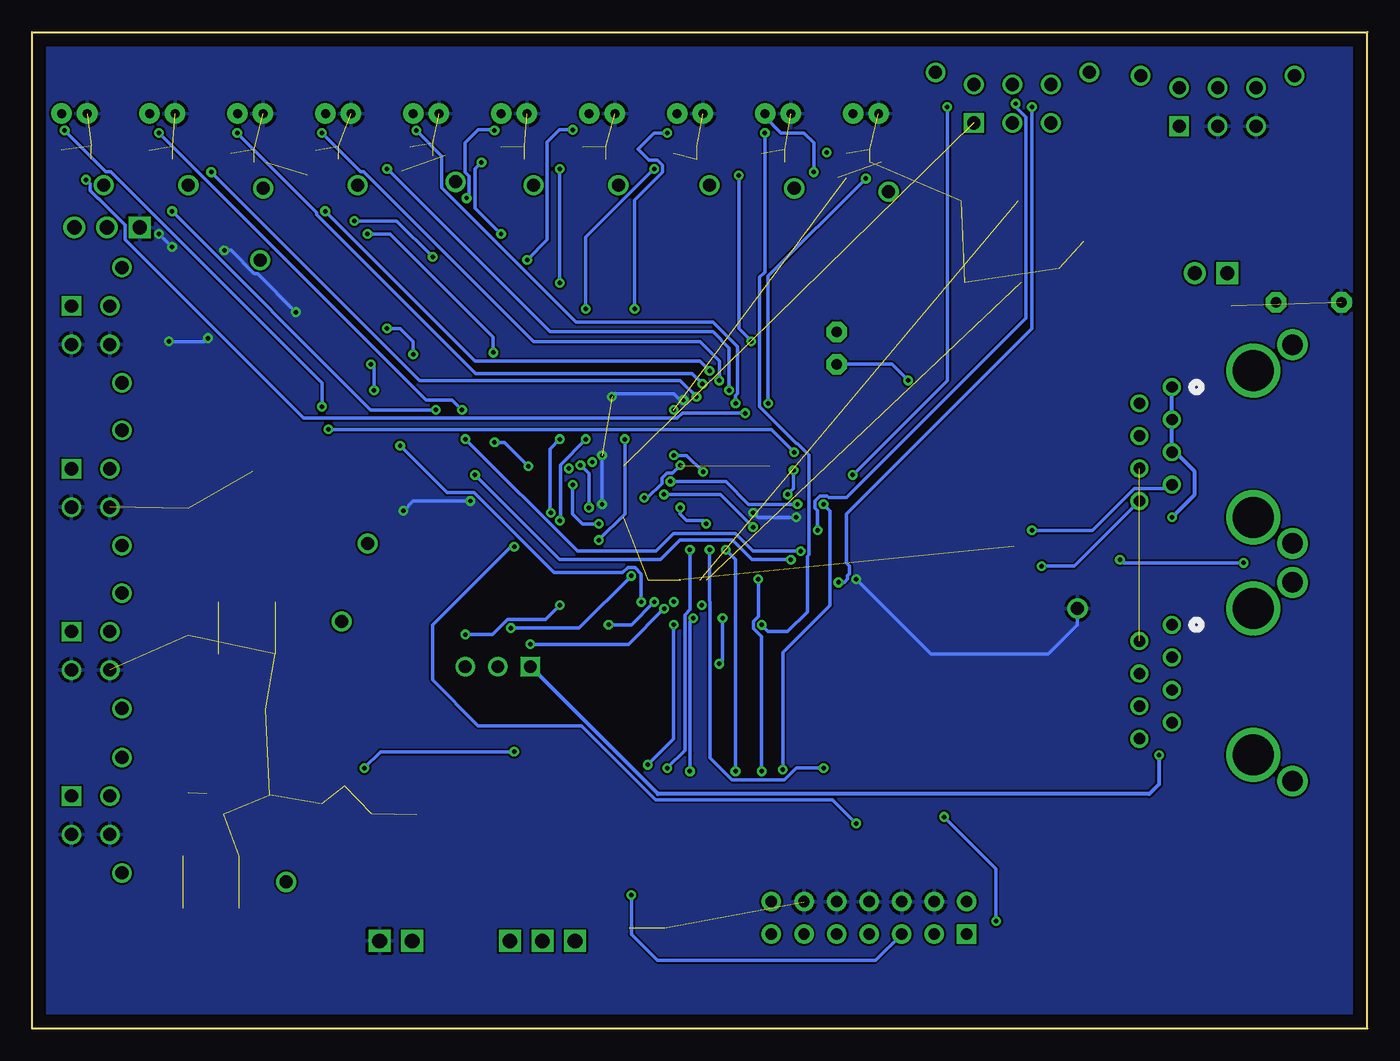
[diagram p4: board, bottom side, seen from below]

Size 104.14 x 77.72 mm. Coordinates in mm from the lower left corner, seen from the top.
Outline: 0,0 104.14,0 104.14,77.72 0,77.72 0,0
Copper layers (1*16): Top 0.035mm / dielectric 1.5mm / Bottom 0.035mm
Design rules "default": minimum track width 6mil, minimum drill 0.35mm, track to track 6mil, track to pad 6mil, pad to pad 6mil, via to via 6mil, smd to smd 6mil, copper to edge 40mil, drill to drill 6mil, minimum pad ring 10mil, minimum via ring 8mil, stop-mask expansion 4mil, vias tented up to drill 0mil, thermal gap 10mil

### Footprints (pad centres in the part's own frame; a part is rotated, then mirrored left to right if it is on the bottom)
C0603 = smd 0.75 x 0.94: 1 -0.7,0; 2 0.7,0
C0402 = smd 0.6 x 0.62: 1 -0.46,0; 2 0.46,0
C5B3.5 = drill 0.813 pad 1.6 octagon: 1 -2.54,0; 2 2.54,0
C2.5-4 = drill 0.813 pad 1.6 octagon: 1 -1.27,0; 2 1.27,0
1206 = smd 1.6 x 1.8: 1 -1.4,0; 2 1.4,0
0603 = smd 1.1 x 1: 1 -0.85,0; 2 0.85,0
CONN_4-LPS-N-R_ASM = drill 0.889 pad 1.397: 1 0,0; 2 1.27,2.54; 3 2.54,0; 4 3.81,2.54; 5 5.08,0; 6 6.35,2.54; 7 7.62,0; 8 8.89,2.54 | drill 3.2 pad 3.708: 9 -1.27,-6.35; 10 10.16,-6.35 | drill 1.6 pad 2.108: 11 -3.302,-9.398; 12 12.192,-9.398
LEDC1608X35N_FLAT-Y = smd 0.612 x 0.912: A 0.75,0; C -0.75,0
SMB = smd 2.4 x 2.4: A 2.2,0; C -2.2,0
SOT23 = smd 1 x 1.4: 1 -0.95,-1.1; 2 0.95,-1.1; 3 0,1.1
SOD23 = smd 1.312 x 0.895: 1 -1.256,0; 2 1.256,0
LEDC2012X110N_FLAT-R = smd 0.762 x 1.362: A 1.025,0; C -1.025,0
7-SIP = drill 1.143 square: 1 0.076,-0.279; 2 2.616,-0.279; 3 5.156,-0.279; 6 12.776,-0.279; 7 15.316,-0.279
SOT23-5 = smd 1.238 x 0.629: 1 -1.241,0.95; 2 -1.241,0; 3 -1.241,-0.95; 4 1.241,-0.95; 5 1.241,0.95
HEADER-V-1X2 = drill 1.105 pad 1.705 square: 1 0,0 | drill 1.105 pad 1.705: 2 2.54,0
JST-2-PTH-NS = drill 0.7 pad 1.6: 1 -1,0; 2 1,0
R0603 = smd 1 x 1.1: 1 -0.85,0; 2 0.85,0
KEYSTONE_5001_0 = drill 1.016 pad 1.57: 1 0,0
S-PQFP-G64 = smd 1.5 x 0.3: 1 -5.7,3.75; 2 -5.7,3.25; 3 -5.7,2.75; 4 -5.7,2.25; 5 -5.7,1.75; 6 -5.7,1.25; 7 -5.7,0.75; 8 -5.7,0.25; 9 -5.7,-0.25; 10 -5.7,-0.75; 11 -5.7,-1.25; 12 -5.7,-1.75; 13 -5.7,-2.25; 14 -5.7,-2.75; 15 -5.7,-3.25; 16 -5.7,-3.75; 33 5.7,-3.75; 34 5.7,-3.25; 35 5.7,-2.75; 36 5.7,-2.25; 37 5.7,-1.75; 38 5.7,-1.25; 39 5.7,-0.75; 40 5.7,-0.25; 41 5.7,0.25; 42 5.7,0.75; 43 5.7,1.25; 44 5.7,1.75; 45 5.7,2.25; 46 5.7,2.75; 47 5.7,3.25; 48 5.7,3.75 | smd 0.3 x 1.5: 17 -3.75,-5.7; 18 -3.25,-5.7; 19 -2.75,-5.7; 20 -2.25,-5.7; 21 -1.75,-5.7; 22 -1.25,-5.7; 23 -0.75,-5.7; 24 -0.25,-5.7; 25 0.25,-5.7; 26 0.75,-5.7; 27 1.25,-5.7; 28 1.75,-5.7; 29 2.25,-5.7; 30 2.75,-5.7; 31 3.25,-5.7; 32 3.75,-5.7; 49 3.75,5.7; 50 3.25,5.7; 51 2.75,5.7; 52 2.25,5.7; 53 1.75,5.7; 54 1.25,5.7; 55 0.75,5.7; 56 0.25,5.7; 57 -0.25,5.7; 58 -0.75,5.7; 59 -1.25,5.7; 60 -1.75,5.7; 61 -2.25,5.7; 62 -2.75,5.7; 63 -3.25,5.7; 64 -3.75,5.7
SC70 = smd 1.186 x 0.397: 1 -0.962,0.65; 2 -0.962,0; 3 -0.962,-0.65; 4 0.962,-0.65; 5 0.962,0; 6 0.962,0.65
CONV_R-78E5.0-0.5 = drill 1 square: 1 -2.54,-2.25 | drill 1: 2 0,-2.25; 3 2.54,-2.25
DUB-R-PDSO-G8 = smd 0.6 x 2.2: 1 -3.81,-4.445; 2 -1.27,-4.445; 3 1.27,-4.445; 4 3.81,-4.445; 5 3.81,4.445; 6 1.27,4.445; 7 -1.27,4.445; 8 -3.81,4.445
HEADER-V-1X3 = drill 1.105 pad 1.705 square: 1 0,0 | drill 1.105 pad 1.705: 2 2.54,0; 3 5.08,0
0430450412 = drill 1.02 square: 1 1.5,-1.5 | drill 1.02: 2 -1.5,-1.5; 3 1.5,1.5; 4 -1.5,1.5; NC@1 4.5,2.44; NC@2 -4.5,2.44
0430450612 = drill 1.02 square: 1 3,-1.5 | drill 1.02: 2 0,-1.5; 3 -3,-1.5; 4 3,1.5; 5 0,1.5; 6 -3,1.5; NC@1 6,2.44; NC@2 -6,2.44
HEADER-V-2X7 = drill 0.89 pad 1.52 square: 1 -7.62,-1.27 | drill 0.89 pad 1.52: 2 -7.62,1.27; 3 -5.08,-1.27; 4 -5.08,1.27; 5 -2.54,-1.27; 6 -2.54,1.27; 7 0,-1.27; 8 0,1.27; 9 2.54,-1.27; 10 2.54,1.27; 11 5.08,-1.27; 12 5.08,1.27; 13 7.62,-1.27; 14 7.62,1.27

### Placement (x,y rotation side)
C1  54.1,7.87 0 top
C2  9.91,56.39 0 top
C3  75.44,50.8 0 top
C4  75.44,49.28 0 top
C5  75.44,47.75 0 top
C6  56.9,7.87 0 top
C7  91.95,29.97 90 top
C8  86.61,24.89 180 top
C9  78.74,45.47 180 top
C10  91.95,39.88 90 top
C11  89.92,16.76 180 top
C12  85.6,17.53 90 top
C13  91.95,59.18 90 top
C14  83.57,51.56 90 top
C17  38.35,68.58 0 top
C18  38.35,67.56 0 top
C19  86.36,68.58 0 top
C20  86.36,67.56 0 top
C21  79.76,68.83 0 top
C22  79.76,67.82 0 top
C23  72.39,69.09 0 top
C24  72.39,68.07 0 top
C25  99.06,68.83 0 top
C26  99.06,67.82 0 top
C27  92.71,68.83 0 top
C28  92.71,67.82 0 top
C29  44.96,68.58 0 top
C30  44.96,67.56 0 top
C31  51.82,68.83 0 top
C32  51.82,67.82 0 top
C33  58.93,68.83 0 top
C34  58.93,67.82 0 top
C35  65.28,68.83 0 top
C36  65.28,67.82 0 top
C37  4.57,56.64 0 top
C38  41.4,53.09 270 top
C39  57.15,2.79 180 top
C40  79.76,17.53 90 top
C41  76.96,16.76 0 top
C42  74.17,17.53 270 top
CAN3  15.24,50.04 270 top
CAN4  15.24,31.5 270 top
D1  68.07,41.4 180 top
D2  87.38,33.27 180 top
D3  87.38,29.21 180 top
D4  89.15,43.43 180 top
D5  78.49,42.67 180 top
D6  90.17,9.4 180 top
D7  90.17,13.46 180 top
D8  89.92,55.63 180 top
D9  89.92,51.56 180 top
D10  29.46,64.52 0 top
D11  29.21,58.17 0 top
D12  23.11,62.48 0 top
D13  23.11,58.17 180 top
D14  57.4,4.83 0 top
D15  22.61,37.34 180 top
DC3  61.72,7.11 0 top
DC4  82.8,17.53 0 top
J1  10.92,58.93 0 top
J2  39.12,71.37 0 top
J3  87.12,71.37 0 top
J4  80.26,71.37 0 top
J5  73.41,71.37 0 top
J6  100.84,71.37 0 top
J7  93.98,71.37 0 top
J8  45.97,71.37 0 top
J9  52.83,71.37 0 top
J10  59.69,71.37 0 top
J11  66.55,71.37 0 top
R1  65.28,41.4 180 top
R2  10.16,54.86 0 top
R3  16.26,56.64 90 top
R4  88.9,25.65 90 top
R5  91.19,26.42 0 top
R6  93.47,27.18 90 top
R7  93.47,30.23 90 top
R8  84.33,38.86 270 top
R9  87.63,37.08 90 top
R10  93.47,39.88 90 top
R11  93.47,42.93 90 top
R12  87.38,17.53 90 top
R13  40.39,65.02 0 top
R14  89.15,64.77 0 top
R15  81.79,65.02 0 top
R16  74.17,65.53 0 top
R17  101.47,65.15 0 top
R18  95,65.28 0 top
R19  47.75,65.02 0 top
R20  54.36,65.02 0 top
R21  61.72,65.28 0 top
R22  68.07,65.53 0 top
R23  14.73,64.01 180 top
R24  17.78,64.01 180 top
R25  19.56,66.55 90 top
R26  16,65.53 180 top
R27  77.22,18.54 0 top
R28  89.66,18.29 0 top
R29  91.95,17.53 270 top
R30  93.47,17.53 90 top
R31  85.34,48.77 0 top
R32  88.39,48.77 0 top
R33  91.44,48.77 0 top
R34  93.47,58.93 90 top
TP1  80.01,31.75 90 top
TP2  77.98,37.85 90 top
TP3  84.33,11.43 90 top
TP4  37.34,65.28 0 top
TP5  86.11,65.53 0 top
TP6  78.74,65.79 0 top
TP7  71.12,66.04 0 top
TP8  98.55,65.79 0 top
TP9  91.95,65.79 0 top
TP10  44.7,65.53 0 top
TP11  51.31,65.79 0 top
TP12  58.42,65.79 0 top
TP13  65.02,65.79 0 top
TP14  22.61,32.77 0 top
TP15  86.36,59.94 90 top
U1  52.32,40.64 0 top
U5  40.64,67.31 270 top
U6  88.65,67.31 270 top
U7  82.04,67.56 270 top
U8  74.68,67.82 270 top
U9  101.85,67.56 270 top
U10  95,67.56 270 top
U11  47.24,67.31 270 top
U12  54.1,67.31 270 top
U13  61.21,67.82 270 top
U14  67.56,67.82 270 top
U15  67.82,30.48 0 top
U16  32,36.32 270 top
U$2  95.76,62.48 0 top
X1  99.57,29.46 90 top
X2  99.57,42.16 90 top
X3  99.57,16.64 90 top
X4  99.57,54.86 90 top
X5  27.69,72.14 0 top
X6  11.68,71.88 0 top
X8  38.86,8.64 0 top

### Tracks (layer width: path | path; a pad name or v marks a point on that pad's centre or on a via)
+3V3  (via drill 0.35)
  Top 0.254: R27.2 78.07,20.15 v78.23,20.32 | v66.55,21.59 29.46,21.59 20.83,30.23 20.83,36.59 D15.A 20.07,37.34 v19.3,36.58 | C37.2 5.29,54.82 5.23,54.82 4.36,53.95 4.36,37.23 5.23,36.37 9.1,36.37 9.14,36.32 v9.65,36.32
  Top 0.305: D15.A 24.38,40.13 U16.1
  Top 0.508: C37.2 9.66,59.19 9.66,59.95 9.9,60.19 10.06,60.19 R23.2 12.19,64.01 10.16,66.04 10.16,71.91 X6.6
  Bottom 0.254: v78.23,20.32 76.96,21.59 v66.55,21.59 | v9.65,36.32 19.05,36.32 v19.3,36.58
+5V
  Top 0.305: DC3.6 74.5,15 C41.1 77.04,15.99 78.16,15.99 78.3,16.13 C40.1 80.21,16.58 DC4.3 82.93,16.58 83.12,16.76 83.12,18.22 83.06,18.29 81.75,18.29 DC4.1
+12V  (via drill 0.35)
  Top 0.305: v15.24,39.88 CAN4.1 CAN4.3 CAN4.5 15.24,25.64 16.24,24.64 16.24,21.35 v16.26,21.34
  Bottom 0.305: v15.24,39.88 13.46,41.66 13.46,43.43 14.99,44.96 CAN3.5 CAN3.3 CAN3.1 | v16.26,21.34 16.26,19.05 17.02,18.29 55.34,18.29 U15.1
+VIN
  Top 0.305: DC3.2 63.94,6.83 62.75,5.64 59.47,5.64 D14.2 58.66,2.9 C39.1
-VIN
  Top 0.305: DC3.1 61.06,6.1 57.4,6.1 56.15,4.84 D14.1 55.75,4.43 C39.2
CANRX  (via drill 0.35)  (1 unrouted)
  Top 0.254: U1.28 54.07,33.3 v54.09,33.28
CANTX  (via drill 0.35)
  Top 0.254: U1.31 55.57,33.33 v55.63,33.27 | U16.3 34.65,35.05 35.23,34.47 38.17,34.47 44.96,27.69 62.83,27.69 64.41,29.26 70.66,29.26 71.12,29.72 71.12,29.97 v70.36,30.73 | v59.18,31.5 60.71,33.02 v62.99,33.02
  Bottom 0.254: v55.63,33.27 57.4,31.5 v59.18,31.5 | v70.36,30.73 68.24,30.73 67.07,31.9 64.11,31.9 v62.99,33.02
GND  (via drill 0.35)  (54 unrouted)
  Top 0.254: U16.4 22.86,32.51 TP14.1 23.63,33.79 D15.C | X8.12 X8.10 | X8.8 X8.6 | C5.2 C4.2 C3.2 77.98,50.8 78.49,50.29 78.49,46.74 78.04,46.29 C9.2 76.29,43.71 D5.A 76.29,40.22 75.95,39.88 75.69,39.88 v75.18,40.39 | D1.C 68.83,41.4 | 68.83,41.4 69.7,41.4 v69.95,41.15 | U1.39 59.45,39.89 59.69,40.13 v59.69,40.89 | 68.83,41.4 65.53,44.7 60.87,44.7 60.73,44.85 60.19,44.85 60.04,44.7 v59.69,44.7 | U1.55 53.07,48.5 53.34,48.77 v53.34,49.02 | D9.A 87.72,55.37 | 87.72,55.37 D8.A 91.95,59.86 | C14.2 v83.57,55.88 | v89.15,60.71 91.12,60.71 C13.2 91.95,59.86 | U$2.1 95.25,61.98 v94.23,61.98 | v93.22,60.96 92.81,60.56 92.11,59.86 91.95,59.86 | X4.2 X4.4 93.7,53.36 v93.47,53.59 | v90.42,53.85 88.9,55.37 87.72,55.37 | U1.3 47.54,43.39 48.01,42.93 48.01,40.34 v47.91,40.24 | U1.12 44.42,38.89 44.2,39.12 44.2,39.52 v44.55,39.88 44.3,39.62 42.67,39.62 40.89,37.85 40.89,36.07 v39.88,35.05
  Bottom 0.254: v69.95,41.15 74.42,41.15 v75.18,40.39 | v59.69,40.89 v59.69,44.7 | v53.34,49.02 53.59,49.02 54.1,49.53 58.67,49.53 v58.93,49.28 | v83.57,55.88 86.57,58.88 86.8,58.88 88.63,60.71 v89.15,60.71 | v94.23,61.98 v93.22,60.96 | v93.47,53.59 90.68,53.59 v90.42,53.85 | v47.91,40.24 47.55,39.88 v44.55,39.88 | v39.88,35.05 34.04,29.21 24.89,29.21 22.61,31.5 TP14.1
  pour Bottom: 0.25,77.47 103.89,77.47 103.89,0.25 0.25,0.25
GNDCAN  (via drill 0.35)  (1 unrouted)
  Top 0.254: CAN4.2 CAN4.4 CAN4.6 | CAN3.6 CAN3.4 CAN3.2 19.05,50.04 35.31,50.04 v35.81,50.55
  Bottom 0.254: v35.81,50.55 37.08,51.82 C38.2
GPIOEXT0  (via drill 0.35)  (1 unrouted)
  Top 0.254: U1.47 60.16,43.89 v60.46,44.19
GPIOEXT1
  Top 0.254: X5.2 32.33,65.99 32.98,65.99 44.72,54.25 49.46,54.25 56.5,47.21 56.5,45.91 U1.48
GPIOEXT2
  Top 0.254: X5.3 30.18,65.14 30.18,63.2 37.95,55.44 41.85,55.44 42.67,54.61 42.67,44.7 44.49,42.89 U1.4
GPIOEXT3  (via drill 0.35)
  Top 0.254: X5.4 32.44,71.88 v32.77,71.88 | v40.13,43.18 40.92,42.39 U1.5
  Bottom 0.254: v32.77,71.88 32.77,50.55 v40.13,43.18
GPIOEXT4  (via drill 0.35)
  Top 0.254: X5.5 27.69,72.39 v27.43,72.14 | v42.88,38.86 43.35,38.39 U1.13
  Bottom 0.254: v27.43,72.14 27.43,71.86 26.64,71.07 26.64,55.4 40.64,41.4 42,41.4 42.15,41.55 42.69,41.55 43.08,41.17 43.08,40.62 42.88,40.43 v42.88,38.86
GPIOEXT5  (via drill 0.35)
  Top 0.254: X5.6 26.16,72.16 v26.16,71.88 | U1.14 42.88,37.89 41.4,36.41 41.4,34.8 v41.25,34.8
  Bottom 0.254: v26.16,71.88 26.16,54.61 40.64,40.13 40.64,36.32 40.39,36.07 40.39,35.47 40.54,35.32 40.54,35.05 40.79,34.8 v41.25,34.8
I2CSCL  (1 unrouted)
  Top 0.254: U1.23
  Top 0.508: R24.2 16.93,65.45 R26.1 | R23.1 R24.2 | D11.C 25.91,57.07 D13.3 22.02,58.16 21.5,58.16 16.93,62.73 R24.2
I2CSDA  (via drill 0.35)  (1 unrouted)
  Top 0.254: U1.24 52.07,33.18 v51.92,33.02
  Top 0.508: R24.1 18.63,64.77 R25.1 21,65.7 D12.3 24.05,64.52 D10.C
N$1
  Top 0.254: R1.2 60.96,41.4 60.45,41.91 58.04,41.91 U1.43
N$2
  Top 0.254: D1.A R1.1
N$3
  Top 0.305: J1.2 14.82,58.93 R3.2
N$4  (via drill 0.35)
  Top 0.254: U16.7 32.77,37.59 31.5,38.86 v26.16,38.86
  Top 0.305: R3.1 16.26,43.43 CAN3.7 14.24,41.41 14.24,26 15.24,25 CAN4.7
  Bottom 0.254: CAN3.7 15.53,42.13 18.19,42.13 21.45,38.86 v26.16,38.86
N$5  (via drill 0.35)
  Top 0.254: U1.25 v52.57,32.01 v52.58,32 | C1.1 53.4,19.5 v52.83,20.07
  Bottom 0.254: v52.83,20.07 52.83,21.52 52.83,21.53 52.83,31.75 v52.58,32
N$6  (via drill 0.35)
  Top 0.254: U16.6 35.43,36.07 v25.4,36.07
  Top 0.305: J1.1 13.25,56.6 16.93,56.6 17.11,56.42 17.11,55.17 16.76,54.82 16.76,42.16 CAN3.8 17.78,31.64 16.78,30.64 16.78,24.73 17.78,23.73 CAN4.8
  Bottom 0.254: v25.4,36.07 22.86,36.07 CAN3.8
N$7
  Top 0.305: X1.3 93.58,30.96 R7.2
N$8  (via drill 0.35)
  Top 0.254: C6.1 56.2,18.73 v54.61,20.32 | v52.83,37.34 52.83,43.18 52.58,43.43 U1.56
  Bottom 0.254: v52.83,37.34 52.83,32.68 53.24,32.28 53.24,21.69 v54.61,20.32
N$9  (1 unrouted)
  Top 0.305: R6.2 R7.1 93.37,29.27 C7.1 89.64,29.27 D3.C
N$10
  Top 0.305: R5.2 93.38,26.42 R6.1
N$11
  Top 0.305: R4.2 90.25,26.5 R5.1
N$12
  Top 0.305: R11.2 97.96,43.78 X2.3
N$13
  Top 0.254: C9.1 79.44,43.92 D5.C 82.93,44.91 88.27,44.91 89.75,43.43 D4.C
  Top 0.305: R10.2 R11.1 92.71,42.08 D4.C
N$14
  Top 0.305: R9.2 92.38,37.93 R10.1
N$15
  Top 0.305: R8.2 85.85,38.01 R9.1
N$16
  Top 0.305: X3.3 93.71,18.14 R30.2
N$17  (1 unrouted)
  Top 0.305: C11.1 91.86,16.76 R29.2 | R29.2 R30.1 | R29.2 92.37,16.25 D7.C
N$18  (1 unrouted)
N$19
  Top 0.305: R12.2 88.72,18.38 R28.1
N$20
  Top 0.305: X4.3 96.89,56.36 R34.2
N$21
  Top 0.305: U5.4 39.99,65.48 R13.1
  Top 0.508: J2.2 38.08,69.34 35.81,69.34 35.05,68.58 35.05,65.79 35.56,65.28 TP4.1 39.28,65.28 R13.1
N$23
  Top 0.254: TP9.1 90.93,66.8 90.93,69.34 91.88,70.3 93.43,70.3 94.51,71.37 J7.2
  Top 0.305: TP9.1 92.46,65.28 R18.1 94.15,66.4 U10.4
N$25
  Top 0.254: TP5.1 84.58,67.06 84.58,68.83 85.85,70.1 87.38,70.1 88.12,70.85 J3.2
  Top 0.305: TP5.1 86.87,64.77 R14.1 88,65.08 U6.4
N$29
  Top 0.254: TP6.1 77.72,66.8 77.72,69.34 78.49,70.1 80.26,70.1 81.26,71.1 J4.2
  Top 0.305: TP6.1 79.5,65.02 R15.1 80.94,66.15 U7.4
N$33
  Top 0.254: TP7.1 70.87,66.29 70.87,69.6 71.56,70.3 72.85,70.3 73.93,71.37 J5.2
  Top 0.305: TP7.1 71.88,66.04 72.39,65.53 R16.1 73.32,66.15 U8.4
N$35  (via drill 0.35)
  Top 0.254: TP10.1 44.45,65.53 v43.18,66.8
  Top 0.305: TP10.1 46.39,65.53 | 46.39,65.53 R19.1 | U11.4 46.59,65.73 46.39,65.53
  Bottom 0.254: v43.18,66.8 43.18,69.09 43.94,69.85 45.72,69.85 46.97,71.1 J8.2
N$37
  Top 0.305: J6.2 100.12,69.66 100.12,67.38 99.31,66.57 99.31,66.55 TP8.1 99.19,65.15 R17.1 100.62,66.02 U9.4
N$42
  Top 0.305: J9.2 53.83,69.88 52.95,68.99 52.95,67.43 TP11.1 52.07,65.02 R20.1 53.51,66.29 U12.4
N$45
  Top 0.305: J10.2 60.69,70.13 60.06,69.5 60.06,67.43 TP12.1 58.93,65.28 R21.1 60.56,65.59 U13.4
N$48
  Top 0.305: J11.2 66.34,70.17 66.34,67.38 65.53,66.57 65.53,66.29 65.15,65.91 | 65.15,65.91 TP13.1 | 65.15,65.91 65.53,65.53 R22.1 66.91,65.84 U14.4
N$51
  Top 0.508: X6.4 14.68,72.49 13.51,71.31 13.51,69.14 13.46,69.09 13.46,67.22 R26.2
N$52
  Top 0.508: X6.1 16.57,70.38 R25.2
N$53
  Top 0.305: C13.1 93.07,58.48 R34.1 93.47,56.98 D8.C D9.C 92.29,51.39 R33.2
N$54
  Top 0.305: R33.1 R32.2
N$56
  Top 0.254: U15.2 67.18,28.23 66.15,27.2 41.76,27.2 U16.5
N$57
  Top 0.254: C38.1 36.45,49.4 U16.8
N$58
  Top 0.305: C42.1 76.2,18.38 R27.1 77.22,19.39 77.22,20.83 77.98,21.59 82.3,21.59 84.05,19.84 DC4.5
N$59
  Top 0.305: R32.1 R31.2
RESET  (via drill 0.35)
  Top 0.254: U1.38 59.92,39.39 v59.94,39.37 | R2.1 9.31,54.27 11.28,52.3 11.28,20.22 21.59,9.91 X8.2 37.34,16 v39.88,16 | v61.98,42.42 62.74,43.18 64.77,43.18 65.28,42.67 65.28,38.86 v66.55,37.59
  Bottom 0.254: v39.88,16 41.73,17.86 55.52,17.86 61.28,23.62 69.34,23.62 72.9,27.18 72.9,31.5 66.8,37.59 v66.55,37.59 | v59.94,39.37 61.21,39.37 61.98,40.13 v61.98,42.42
TCK  (via drill 0.35)
  Top 0.254: U1.52 54.57,45.18 v54.1,44.7 | X8.9 X8.11 45.44,8.87 45.44,10.34 49.28,14.17 v49.28,20.07 | v51.82,43.43 50.04,41.66 v50.04,37.34
  Bottom 0.254: v49.28,20.07 49.28,36.58 v50.04,37.34 | v51.82,43.43 53.09,44.7 v54.1,44.7
TDI  (via drill 0.35)
  Top 0.254: U1.50 55.5,46.27 55.5,43.89 54.36,42.74 v54.36,42.67 | X8.3 35.28,8.87 35.28,10.34 35.89,10.95 36.6,10.95 45.72,20.07 v45.59,20.19 | v42.42,40.89 v44.45,40.89
  Bottom 0.254: v45.59,20.19 45.59,29.34 41.91,33.02 41.91,40.39 v42.42,40.89 | v44.45,40.89 48.26,40.89 50.04,42.67 v54.36,42.67
TDO  (via drill 0.35)
  Top 0.254: U1.49 56.07,42.87 v54.86,41.66 | X8.7 40.36,8.87 40.36,10.34 47.24,17.22 v47.24,20.07 | v47.5,35.05 47.5,36.47 47.65,36.62 47.65,38.85 v47.92,39.12
  Bottom 0.254: v47.24,20.07 47.24,30.57 47.89,31.22 47.89,31.76 47.5,32.16 v47.5,35.05 | v47.92,39.12 50.46,41.66 v54.86,41.66
TIVAD1  (via drill 0.35)
  Top 0.254: U5.3 39.39,67.68 39.39,67.14 39.12,66.86 v39.12,66.29 | U1.57 52.07,45.47 51.05,44.45 49.17,44.45 49.09,44.52 48.14,45.47 48.14,47.36 v46.74,48.77
  Bottom 0.254: v39.12,66.29 46.74,58.67 v46.74,48.77
TIVAD2  (via drill 0.35)
  Top 0.254: U1.59 51.07,47.34 51.61,47.87 51.61,50.04 v51.86,50.29 | U6.3 88,69.71 v88.14,69.85
  Bottom 0.254: v88.14,69.85 81.94,63.65 81.94,63.48 69.55,51.1 52.67,51.1 v51.86,50.29
TIVAD3  (via drill 0.35)
  Top 0.254: U1.61 50.07,47.49 50.44,47.85 50.44,50.44 v50.55,50.55 | U7.3 81.39,69.71 v81.53,69.85
  Bottom 0.254: v81.53,69.85 78.53,66.85 78.3,66.85 65.04,53.59 52.07,53.59 50.55,52.07 v50.55,50.55
TIVAD4  (via drill 0.35)
  Top 0.254: U1.63 49.07,47.64 49.17,47.73 49.17,48.66 v49.28,48.77 | U8.3 74.03,69.9 v74.17,70.04
  Bottom 0.254: v74.17,70.04 72.18,68.06 72.18,65.6 61.7,55.12 51.05,55.12 49.13,53.19 49.13,49.51 49.28,49.36 v49.28,48.77
TIVAD5  (via drill 0.35)
  Top 0.254: U1.1 45.27,44.39 v44.7,44.96 | U9.3 101.2,69.65 v101.6,70.04 | v81.53,48.51 81.53,47.24 v81.03,46.74
  Bottom 0.254: v101.6,70.04 98.41,66.85 98.02,66.85 81.53,50.36 v81.53,48.51 | v81.03,46.74 46.48,46.74 v44.7,44.96
TIVAD6  (via drill 0.35)
  Top 0.254: U1.16 45.27,36.89 v44.96,36.58 | U10.3 94.35,69.74 v94.23,69.85 | v70.61,48.26 69.6,47.24 v69.6,43.18
  Bottom 0.254: v94.23,69.85 73.41,49.02 71.37,49.02 v70.61,48.26 | v69.6,43.18 62.99,36.58 55.12,36.58 53.59,38.1 49.53,38.1 48.01,36.58 v44.96,36.58
TIVAD7  (via drill 0.35)
  Top 0.254: U1.18 49.07,34.03 47.24,32.2 v47.24,31.5 v47.24,31.49 | U11.3 46.59,69.45 v46.99,69.85
  Bottom 0.254: v46.99,69.85 46.99,59 47.39,58.59 47.39,48.5 44.51,45.62 44.43,45.62 43.54,44.72 43.54,36.96 43.69,36.81 43.69,32.51 45.21,30.99 46.74,30.99 v47.24,31.49
TIVAD8  (via drill 0.35)
  Top 0.254: U12.3 53.62,68.44 53.62,68.98 53.79,69.14 53.91,69.14 v54.61,69.85 | U1.20 50.07,33.95 49.99,33.87 49.99,33.78 49.12,32.92 49.11,32.92 48.73,32.53 48.73,30.52 49.53,29.72 61.47,29.72 70.61,38.86 70.61,41.66 69.75,42.52 69.32,42.52 66.53,45.32 64.16,45.32 | 64.16,45.32 64.26,45.21 | 64.16,45.32 60.69,45.32 57.15,48.85 v57.15,56.13
  Bottom 0.254: v54.61,69.85 55.63,69.85 56.9,68.58 56.03,67.71 55.35,67.71 54.97,67.33 54.97,66.78 57.15,64.6 v57.15,56.13
TIVAD9  (via drill 0.35)
  Top 0.254: U13.3 60.74,68.95 60.74,69.49 61.35,70.1 v61.98,70.1 | 51.05,34.92 U1.22 51.07,33.8 50.8,33.53 50.8,32.51 v50.29,32 | v65.53,59.94 65.53,56.3 73.3,48.53 73.3,39.52 62.23,28.45 v50.55,28.45
  Bottom 0.254: v61.98,70.1 62.99,70.1 63.96,69.14 63.96,61.52 v65.53,59.94 | v50.55,28.45 50.29,28.7 v50.29,32
TIVAD10  (via drill 0.35)
  Top 0.254: U14.3 67.09,68.95 67.09,69.49 67.25,69.65 67.68,69.65 v68.07,70.04 | 55.12,34.9 U1.30 55.07,33.65 54.97,33.55 54.97,32.87 v54.86,32.76 | v70.25,64.77 75.39,59.63 75.39,47.17 74.17,45.94 74.17,35.56 68.58,29.97 v65.28,29.97
  Bottom 0.254: v68.07,70.04 68.13,70.1 69.34,70.1 70.36,69.09 70.36,66.78 70.06,66.48 70.06,64.97 v70.25,64.77 | v65.28,29.97 57.64,29.97 v54.86,32.76
TIVADIR1  (via drill 0.35)  (1 unrouted)
  Top 0.254: U5.5 40.81,66.52 40.81,67.06 40.98,67.22 41.42,67.22 42.16,67.96 v42.16,68.33 | U1.53 54.07,48.23 v54.1,48.26
TIVADIR2  (via drill 0.35)
  Top 0.254: U1.58 51.57,47.26 52.02,47.71 52.02,48.97 v52.32,49.28 | U6.5 88.82,66.52 88.82,67.06 88.98,67.22 89.61,67.22 90.03,66.8 v90.17,66.8
  Bottom 0.254: v90.17,66.8 73.91,50.55 53.59,50.55 v52.32,49.28
TIVADIR3  (via drill 0.35)
  Top 0.254: U1.60 50.57,47.41 51.2,48.04 51.2,51.2 v51.31,51.31 | U7.5 81.87,66.43 81.87,65.89 81.77,65.79 81.77,64.41 81.28,63.92 v81.28,63.75
  Bottom 0.254: v81.28,63.75 69.6,52.07 52.07,52.07 v51.31,51.31
TIVADIR4  (via drill 0.35)
  Top 0.254: U1.62 49.57,47.56 49.93,47.92 49.93,49.04 49.78,49.19 v49.78,49.78 | U8.5 74.68,67.56 74.93,67.82 75.69,67.82 v76.45,67.06
  Bottom 0.254: v76.45,67.06 63.75,54.36 51.05,54.36 49.78,53.09 v49.78,49.78
TIVADIR5  (via drill 0.35)
  Top 0.254: U1.64 48.57,47.95 v48.51,48.01 | U9.5 101.68,66.77 101.68,67.31 101.52,67.47 100.89,67.47 100.73,67.31 100.73,66.99 v99.94,66.21
  Bottom 0.254: v99.94,66.21 99.62,65.88 99.62,65.34 98.99,64.72 98.94,64.72 96.89,62.68 96.89,61.52 82.98,47.6 53.83,47.6 53.43,48.01 v48.51,48.01
TIVADIR6  (via drill 0.35)
  Top 0.254: U1.15 44.35,37.39 v44.2,37.23 | U10.5 94.97,66.58 94.97,64.66 94.81,64.5 93.96,64.5 v93.22,63.75 | v72.64,48.26 v70.36,45.97
  Bottom 0.254: v93.22,63.75 77.72,48.26 v72.64,48.26 | v44.2,37.23 44.68,37.23 44.69,37.23 47.9,37.23 49.28,38.61 54.1,38.61 55.48,37.23 61.62,37.23 v70.36,45.97
TIVADIR7  (via drill 0.35)
  Top 0.254: U11.5 47.24,67.06 47.5,67.31 48.51,67.31 49.02,66.8 v49.02,66.55 | v48.05,53.59 45.47,51.01 45.47,46.99 48.57,43.88 U1.17
  Bottom 0.254: v49.02,66.55 49.02,54.61 48.01,53.59 v48.05,53.59
TIVADIR8  (via drill 0.35)
  Top 0.254: U12.5 54.27,66.52 54.27,67.06 54.44,67.22 55.07,67.22 55.23,67.06 v55.63,67.06 | v60.96,56.13 v60.96,45.97 | v62.99,39.62 59.83,36.46 57.16,36.46 57.04,36.58 50.04,36.58 49.53,36.07 49.53,34.98 U1.19
  Bottom 0.254: v60.96,56.13 60.96,61.72 v55.63,67.06 | v60.96,45.97 60.96,45.94 62.94,43.96 62.94,39.68 v62.99,39.62
TIVADIR9  (via drill 0.35)
  Top 0.254: 50.55,34.97 U1.21 50.57,33.88 50.39,33.7 50.39,33.12 49.28,32 49.28,31.24 50.04,30.48 54.78,30.48 63.65,39.35 63.65,40.2 v63.68,40.22 | U13.5 61.21,67.56 61.47,67.82 62.48,67.82 62.99,67.31 v62.99,67.06 | v62.99,58.17 v62.99,45.97
  Bottom 0.254: v62.99,67.06 v62.99,58.17 | v62.99,45.97 63.75,45.21 63.75,40.13 63.68,40.21 v63.68,40.22
TIVADIR10  (via drill 0.35)
  Top 0.254: U14.5 67.74,67.03 67.74,67.56 67.9,67.73 68.53,67.73 68.69,67.56 v69.09,67.56 | v67.56,61.98 67.56,54.84 73.71,48.7 73.71,38.15 v66.8,31.24 | U1.29 54.61,34.98 54.61,35.81 54.86,36.07 56.64,36.07 v57.4,35.31
  Bottom 0.254: v69.09,67.56 69.6,67.06 69.6,64.01 v67.56,61.98 | v57.4,35.31 61.47,31.24 v66.8,31.24
TMS  (via drill 0.35)
  Top 0.254: U1.51 55.07,44.39 53.59,42.91 v53.59,40.64 | X8.1 29.97,7.37 v28.96,8.38 | v33.02,16.51 36.83,20.32 v42.42,20.32 | v51.56,39.37 51.56,37.59 v51.31,37.34
  Bottom 0.254: v28.96,8.38 28.96,12.45 v33.02,16.51 | v53.59,40.64 53.59,40.13 53.09,39.62 51.82,39.62 v51.56,39.37 | v51.31,37.34 51.31,33.34 51.26,33.29 51.26,21.12 49.55,19.41 45.45,19.41 44.54,20.32 v42.42,20.32
UARTRX  (via drill 0.35)
  Top 0.254: U1.45 58.09,42.96 61.32,42.96 62.04,43.69 v62.28,43.69 65.02,43.69 65.28,43.94 65.36,43.94 v65.45,43.86 | v68.07,45.72 68.58,45.72 68.83,45.97 68.83,47.5 70.87,49.53 70.87,50.04 v68.18,52.73 | v77.98,61.98 93.22,61.98 94.49,60.71 96.52,60.71 U$2.2
  Bottom 0.254: v65.45,43.86 67.31,45.72 v68.07,45.72 | v68.18,52.73 68.18,53.95 76.2,61.98 v77.98,61.98
UARTTX  (via drill 0.35)
  Top 0.254: U1.46 60.82,43.39 v61.37,43.94 | v60.71,40.64 60.71,38.86 v59.94,38.1 | v57.91,45.97 57.91,47.52 56.49,48.94 56.49,56.41 62.72,62.63 67.84,62.63 70.27,60.2 v72.9,60.2 | v78.99,62.99 94.17,62.99 94.79,63.62 99.71,63.62 U$2.3
  Bottom 0.254: v61.37,43.94 60.71,43.28 v60.71,40.64 | v59.94,38.1 57.91,40.13 v57.91,45.97 | v72.9,60.2 75.69,62.99 v78.99,62.99
VCC  (via drill 0.35)  (4 unrouted)
  Top 0.254: C5.1 C4.1 C3.1 74.74,52.26 v74.42,52.58 | R17.2 102.32,59.14 101.07,57.89 X4.1 | C2.1 9.9,55.69 9.93,55.69 10.75,54.86 R2.2 | U1.26 53.07,33.54 53.09,33.53 53.09,32.51 v54.1,31.5 54.86,31.5 v56.64,33.27 | v56.13,20.57 57.4,19.3 v57.4,10.41 | U1.54 53.57,45.11 53.44,44.98 53.44,44.08 v53.59,43.93 | v56.39,41.4 58.01,41.4 U1.42 | v75.44,45.47 77.22,47.24 77.22,49.53 v77.47,49.78 | v77.72,51.82 77.72,53.59 76.71,54.61 v76.45,54.61 | U1.11 46.55,39.46 45.76,39.46 45.21,40.01 v45.21,41.66 | v44.76,43.55 45.1,43.89 U1.2
  Top 0.305: R13.2 41.29,65.08 U5.6 42.51,67.56 C30.1 | R19.2 47.89,65.73 U11.6 | R17.2 102.32,65.85 102.36,65.88 102.36,66.45 U9.6 | R18.2 95.65,65.48 U10.6 | R14.2 89.3,65.48 U6.6 | R15.2 82.64,66.55 U7.6 | R16.2 75.02,65.97 75.18,66.14 75.18,66.71 U8.6 | R22.2 68.92,66.15 U14.6 | R21.2 61.86,65.99 U13.6 | R20.2 54.75,65.48 U12.6 | X3.1 101.07,25.38 102.89,27.2 102.89,29.14 X1.1 101.07,36.81 102.87,38.61 102.87,41.86 102.06,42.67 101.6,42.67 101.07,43.2 X2.1 102.62,45.21 102.62,54.82 X4.1
  Bottom 0.254: v54.1,31.5 54.1,22.61 v56.13,20.57 | v57.4,10.41 57.4,7.37 55.37,5.33 38.35,5.33 X8.5 | v53.59,43.93 54.19,43.33 54.63,43.33 55.01,42.94 55.01,42.52 56.13,41.4 v56.39,41.4 | v56.64,33.27 56.64,35.47 57.13,35.96 57.68,35.96 58.08,35.56 63.44,35.56 69.68,41.81 71.78,41.81 v75.44,45.47 | v74.42,52.58 74.42,53.59 75.44,54.61 v76.45,54.61 | v77.47,49.78 77.47,51.56 v77.72,51.82 | v45.21,41.66 44.76,42.11 v44.76,43.55
  pour Top: 0.25,77.47 103.89,77.47 103.89,0.25 0.25,0.25
VOUT1
  Top 0.254: TP1.1 83.7,28.06 83.7,27.89 85.95,25.64 86.41,25.64 87.15,24.89 C8.1
  Top 0.305: R4.1 87.4,24.8 C8.1
VOUT2
  Top 0.305: C10.1 84.86,39.18 R8.1 79.84,39.71 TP2.1
VOUT3
  Top 0.254: C12.1 84.94,16.17 84.94,16.15 84.33,15.53 TP3.1
  Top 0.305: R12.1 85.75,16.68 C12.1
VOUT4
  Top 0.305: R31.1 83.57,49.7 C14.1 84.39,50.86 84.84,51.31 84.84,58.42 TP15.1